# Altium project STM32F7-SOM-OLD.PrjPcb
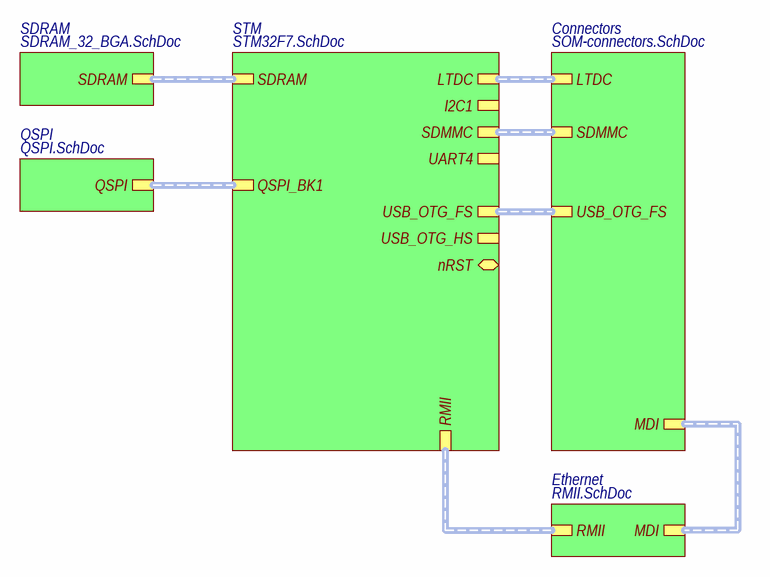
[diagram p0: Top.SchDoc]
Утвердил: Кадыров; ТипДокумента2: Монтажная схема; ТипДокумента1: Схема электрическая принципиальная; Технолог: Терехов; Разработал: Валиуллин; Проверил: Кадыров; ПервичноеПрименение: ВС01; Обозначение2: ="DesignName"+"-5"+"Revision"+"2"; Обозначение1: ="DesignName"+"-5"+"Revision"+"1"; Наименование: Плата лицевой панели; Масштаб: 1:1; Литера1: A; Компания: Eleps; Revision: 1; DesignName: FP01-01
6 sheets, 92 parts. Net scope: hierarchical (ports join the sheet entries above them; power ports are global).
Board file: PCB.PcbDoc
Sheets:
  Top.SchDoc
    SDRAM = SDRAM_32_BGA.SchDoc
    STM = STM32F7.SchDoc
    QSPI = QSPI.SchDoc
    Connectors = SOM-connectors.SchDoc
    Ethernet = RMII.SchDoc

## Sheet Top.SchDoc
size 209 x 297 mm; PageSetup: Record=PageOptions|CenterHorizontal=True|CenterVertical=True|PrintScale=1.00|XCorrection=1.00|YCorrection=1.00|PrintKind=1|BorderSize=5000000|LeftOffset=0|BottomOffset=0|Orientation=2|PaperLength=1000|PaperWidth=1000|Scale=100|PaperSource=15|PrintQuality=1200|MediaType=1|DitherType=10|PaperKind=A3|PrintScaleMode=1; Letter1: A; Scale: 1:1; ListNumber: 1; SheetNumber: 1; SheetTotal: 6

### Sub-sheets
Connectors = SOM-connectors.SchDoc: LTDC (harness LTDC), MDI (harness MDI), SDMMC (harness SDMMC), USB_OTG_FS (harness USB_OTG)
Ethernet = RMII.SchDoc: RMII (harness RMII), MDI (harness MDI)
QSPI = QSPI.SchDoc: QSPI (harness RGMII)
SDRAM = SDRAM_32_BGA.SchDoc: SDRAM (harness SDRAM)
STM = STM32F7.SchDoc: SDRAM (harness SDRAM), QSPI_BK1 (harness QSPI), UART4 (harness UART), SDMMC (harness SDMMC), I2C1 (harness I2C), USB_OTG_FS (harness USB_OTG), USB_OTG_HS (harness USB_OTG), LTDC (harness LTDC), RMII (harness RMII), nRST (bidir)

### Buses and harness runs
harness sheet Connectors/LTDC = sheet STM/LTDC
harness sheet Connectors/MDI = sheet Ethernet/MDI
harness sheet Connectors/SDMMC = sheet STM/SDMMC
harness sheet Connectors/USB_OTG_FS = sheet STM/USB_OTG_FS
harness sheet Ethernet/RMII = sheet STM/RMII
harness sheet QSPI/QSPI = sheet STM/QSPI_BK1
harness sheet SDRAM/SDRAM = sheet STM/SDRAM

### Notes on the sheet
- Перв. примен.
- Справ. №
- Подп. и дата
- Инв. № дубл.
- Взам. инв. №
- Разраб.
- Изм.
- Лист
- № докум.
- Подп.
- Дата
- Лит.
- Масса
- Масштаб
- Пров.
- Т. контр.
- Листов
- Инв. № подл.
- Н. контр.
- Утв.
- Копировал
- Формат А4

## Sheet SDRAM_32_BGA.SchDoc
size 420 x 297 mm; SheetNumber: 4; SheetTotal: 6; ListNumber: 2
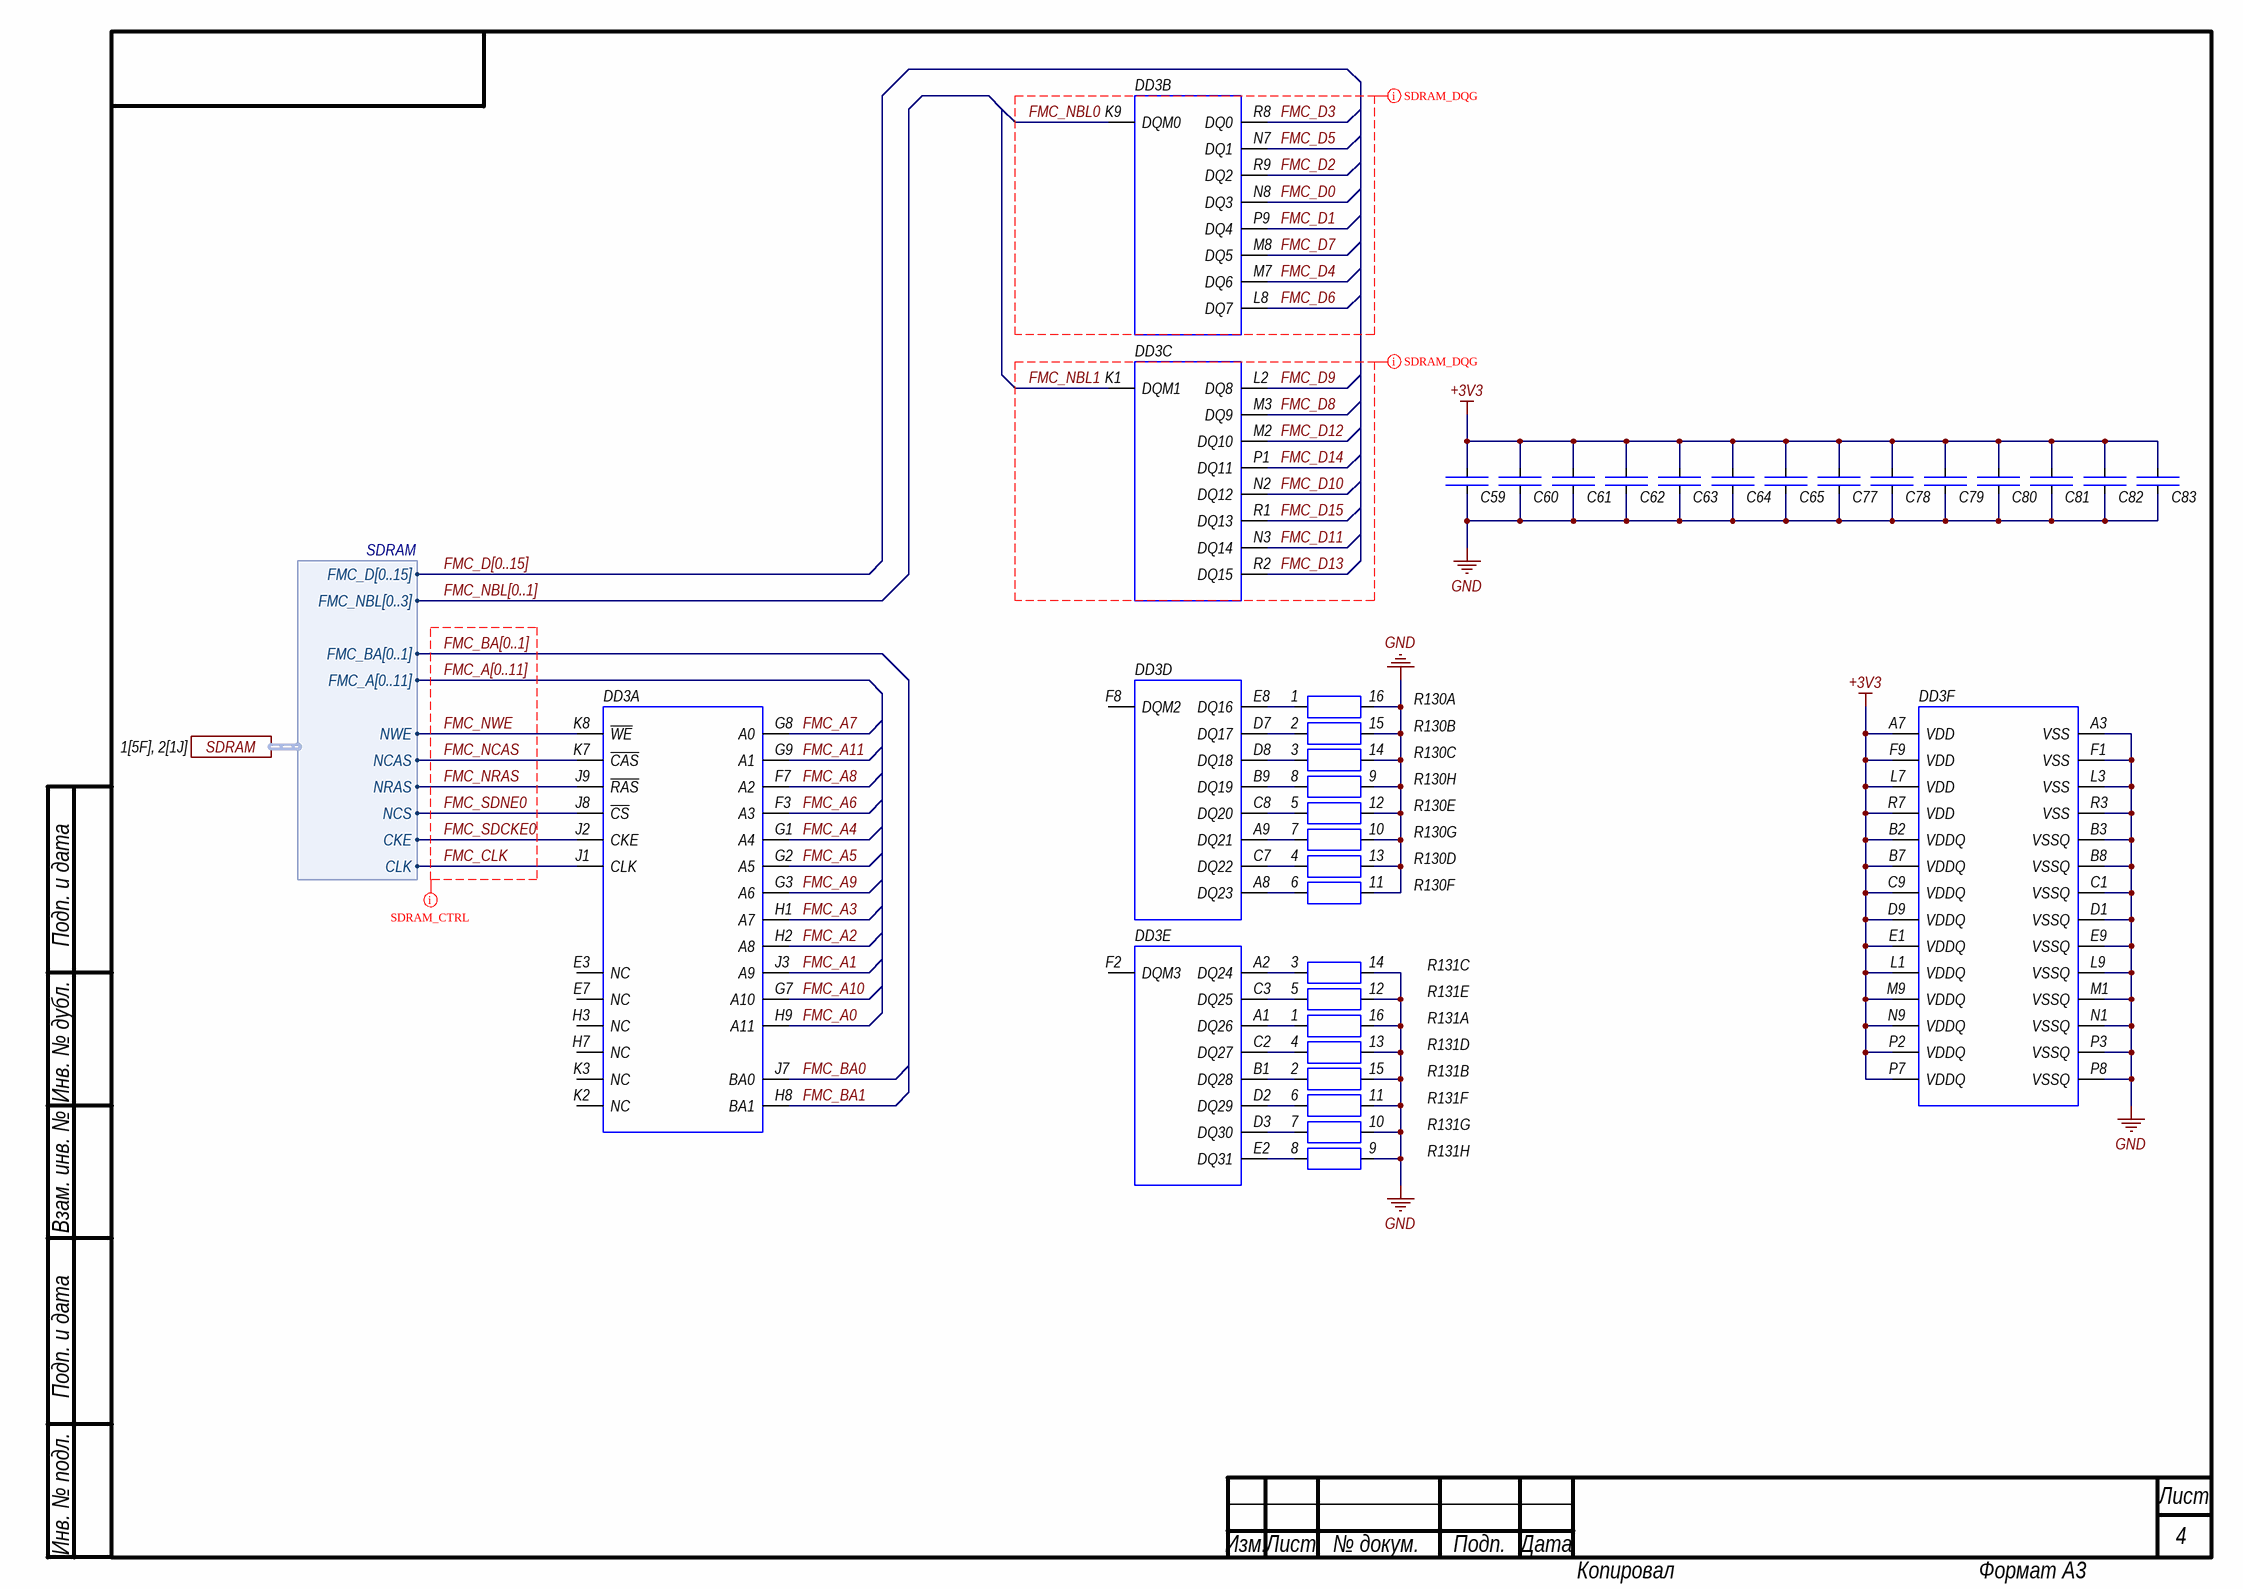
[diagram p1: SDRAM_32_BGA.SchDoc]

### Parts
C59  Конденсатор керам. ЧИП X5R, 10%, 0402, 0.1 мкФ  [Capacitor 0402]  (value not drawn)
C60  Конденсатор керам. ЧИП X5R, 10%, 0402, 0.1 мкФ  [Capacitor 0402]  (value not drawn)
C61  Конденсатор керам. ЧИП X5R, 10%, 0402, 0.1 мкФ  [Capacitor 0402]  (value not drawn)
C62  Конденсатор керам. ЧИП X5R, 10%, 0402, 0.1 мкФ  [Capacitor 0402]  (value not drawn)
C63  Конденсатор керам. ЧИП X5R, 10%, 0402, 0.1 мкФ  [Capacitor 0402]  (value not drawn)
C64  Конденсатор керам. ЧИП X5R, 10%, 0402, 0.1 мкФ  [Capacitor 0402]  (value not drawn)
C65  Конденсатор керам. ЧИП X5R, 10%, 0402, 0.1 мкФ  [Capacitor 0402]  (value not drawn)
C77  Конденсатор керам. ЧИП X5R, 10%, 0402, 0.1 мкФ  [Capacitor 0402]  (value not drawn)
C78  Конденсатор керам. ЧИП X5R, 10%, 0402, 0.1 мкФ  [Capacitor 0402]  (value not drawn)
C79  Конденсатор керам. ЧИП X5R, 10%, 0402, 0.1 мкФ  [Capacitor 0402]  (value not drawn)
C80  Конденсатор керам. ЧИП X5R, 10%, 0402, 0.1 мкФ  [Capacitor 0402]  (value not drawn)
C81  Конденсатор керам. ЧИП X5R, 10%, 0402, 0.1 мкФ  [Capacitor 0402]  (value not drawn)
C82  Конденсатор керам. ЧИП X5R, 10%, 0402, 0.1 мкФ  [Capacitor 0402]  (value not drawn)
C83  Конденсатор керам. ЧИП X5R, 10%, 0402, 0.1 мкФ  [Capacitor 0402]  (value not drawn)
DD3  Микросхема IS42S32400F-6BL  [BGA90C80P9X15_800X1300X120]  (value not drawn)  (parts A,B,C,D,E,F of 6)
R130  8-Resistor  [RESNET_1506-16_CONVEX]  (value not drawn)  (parts A,B,C,D,E,F,G,H of 8)
R131  8-Resistor  [RESNET_1506-16_CONVEX]  (value not drawn)  (parts A,B,C,D,E,F,G,H of 8)

### Ports
SDRAM (harness SDRAM, see 1[5F], 2[1J])

### Harnesses
SDRAM: FMC_D[0..15], NCAS, FMC_BA[0..1], NWE, FMC_A[0..11], NRAS, NCS, CLK, CKE, FMC_NBL[0..3]

### Nets
+3V3: C59.1 C60.1 C61.1 C62.1 C63.1 C64.1 C65.1 C77.1 C78.1 C79.1 C80.1 C81.1 C82.1 C83.1 DD3.A7(VDD) DD3.B2(VDDQ) DD3.B7(VDDQ) DD3.C9(VDDQ) DD3.D9(VDDQ) DD3.E1(VDDQ) DD3.F9(VDD) DD3.L1(VDDQ) DD3.L7(VDD) DD3.M9(VDDQ) DD3.N9(VDDQ) DD3.P2(VDDQ) DD3.P7(VDDQ) DD3.R7(VDD)
GND: C59.2 C60.2 C61.2 C62.2 C63.2 C64.2 C65.2 C77.2 C78.2 C79.2 C80.2 C81.2 C82.2 C83.2 DD3.A3(VSS) DD3.B3(VSSQ) DD3.B8(VSSQ) DD3.C1(VSSQ) DD3.D1(VSSQ) DD3.E9(VSSQ) DD3.F1(VSS) DD3.L3(VSS) DD3.L9(VSSQ) DD3.M1(VSSQ) DD3.N1(VSSQ) DD3.P3(VSSQ) DD3.P8(VSSQ) DD3.R3(VSS) R130.9 R130.10 R130.11 R130.12 R130.13 R130.14 R130.15 R130.16 R131.9 R131.10 R131.11 R131.12 R131.13 R131.14 R131.15 R131.16
FMC_A0: DD3.H9(A11)
FMC_A1: DD3.J3(A9)
FMC_A2: DD3.H2(A8)
FMC_A3: DD3.H1(A7)
FMC_A4: DD3.G1(A4)
FMC_A5: DD3.G2(A5)
FMC_A6: DD3.F3(A3)
FMC_A7: DD3.G8(A0)
FMC_A8: DD3.F7(A2)
FMC_A9: DD3.G3(A6)
FMC_A10: DD3.G7(A10)
FMC_A11: DD3.G9(A1)
FMC_BA0: DD3.J7(BA0)
FMC_BA1: DD3.H8(BA1)
FMC_CLK: DD3.J1(CLK) ; port SDRAM.CLK
FMC_D0: DD3.N8(DQ3)
FMC_D1: DD3.P9(DQ4)
FMC_D2: DD3.R9(DQ2)
FMC_D3: DD3.R8(DQ0)
FMC_D4: DD3.M7(DQ6)
FMC_D5: DD3.N7(DQ1)
FMC_D6: DD3.L8(DQ7)
FMC_D7: DD3.M8(DQ5)
FMC_D8: DD3.M3(DQ9)
FMC_D9: DD3.L2(DQ8)
FMC_D10: DD3.N2(DQ12)
FMC_D11: DD3.N3(DQ14)
FMC_D12: DD3.M2(DQ10)
FMC_D13: DD3.R2(DQ15)
FMC_D14: DD3.P1(DQ11)
FMC_D15: DD3.R1(DQ13)
FMC_NBL0: DD3.K9(DQM0)
FMC_NBL1: DD3.K1(DQM1)
FMC_NCAS: DD3.K7(~{CAS}) ; port SDRAM.NCAS
FMC_NRAS: DD3.J9(~{RAS}) ; port SDRAM.NRAS
FMC_NWE: DD3.K8(~{WE}) ; port SDRAM.NWE
FMC_SDCKE0: DD3.J2(CKE) ; port SDRAM.CKE
FMC_SDNE0: DD3.J8(~{CS}) ; port SDRAM.NCS
NetDD3_A1: DD3.A1(DQ26) R131.1
NetDD3_A2: DD3.A2(DQ24) R131.3
NetDD3_A8: DD3.A8(DQ23) R130.6
NetDD3_A9: DD3.A9(DQ21) R130.7
NetDD3_B1: DD3.B1(DQ28) R131.2
NetDD3_B9: DD3.B9(DQ19) R130.8
NetDD3_C2: DD3.C2(DQ27) R131.4
NetDD3_C3: DD3.C3(DQ25) R131.5
NetDD3_C7: DD3.C7(DQ22) R130.4
NetDD3_C8: DD3.C8(DQ20) R130.5
NetDD3_D2: DD3.D2(DQ29) R131.6
NetDD3_D3: DD3.D3(DQ30) R131.7
NetDD3_D7: DD3.D7(DQ17) R130.2
NetDD3_D8: DD3.D8(DQ18) R130.3
NetDD3_E2: DD3.E2(DQ31) R131.8
NetDD3_E8: DD3.E8(DQ16) R130.1

Not connected (* = marked no-connect by the designer): DD3 E3(NC) E7(NC) F2(DQM3) F8(DQM2) H3(NC) H7(NC) K2(NC) K3(NC)

### Buses and harness runs
bus FMC_A[0..11]
bus FMC_BA[0..1]
bus FMC_D[0..15]
bus FMC_NBL[0..1]

### Layout directives
net class SDRAM_CTRL; rule Matched Net Lengths [Delay Tolerance = 200ps]: FMC_A[0..11], FMC_BA[0..1], FMC_CLK, FMC_NCAS, FMC_NRAS, FMC_NWE, FMC_SDCKE0, FMC_SDNE0
net class SDRAM_DQM0; rule Matched Net Lengths [Delay Tolerance = 100ps]: FMC_D0, FMC_D1, FMC_D2, FMC_D3, FMC_D4, FMC_D5, FMC_D6, FMC_D7, FMC_NBL0
net class SDRAM_DQM1; rule Matched Net Lengths [Delay Tolerance = 100ps]: FMC_D8, FMC_D9, FMC_D10, FMC_D11, FMC_D12, FMC_D13, FMC_D14, FMC_D15, FMC_NBL1

### Notes on the sheet
- Подп. и дата
- Инв. № дубл.
- Взам. инв. №
- Инв. № подл.
- Изм.
- Лист
- № докум.
- Подп.
- Дата
- Копировал
- Формат А3

### Library data of the parts
C59-C65 C77-C83 = 000821-3: Cap Ceramic 0.1uF 50V X5R 10% Pad SMD 0402 85C T/R; Manufacturer: Murata Manufacturing; Manufacturer Part Number: GRM155R61H104KE14J; Device: 100nFx50V; Capacitance: 100nF; PCAD Reader Code: 0; Info: 100nFx50V; Voltage: 50V; Case: 0402; Pin Count: 2; Help URL: https://www.digikey.com/en/products/detail/murata-electronics/GRM155R61H104KE14J/4905153; Storage Code: 0; Dielectric: X5R; Tolerance: 10%
DD3 = IS42S32400F-6BL: 128Mb (4M x 32) Synchronous DRAM; Part Number: IS42S32400F-6BL; Device: IS42S32400F-6BL; Info: IS42S32400F-6BL; Case: 90-Ball TF-BGA; Manufacturer Part Number: IS42S32400F-6BL; Pin Count: 90
R130 R131 = EXB2HV103JV: Manufacturer: Panasonic; Device: 10k; Part Number: EXB2HV103JV; Info: 10k; Resistance: 10k; Case: SMD-1506; Manufacturer Part Number: EXB2HV103JV; Pin Count: 16

## Sheet STM32F7.SchDoc
size 840 x 594 mm; SheetNumber: 2; SheetTotal: 6; ListNumber: 2
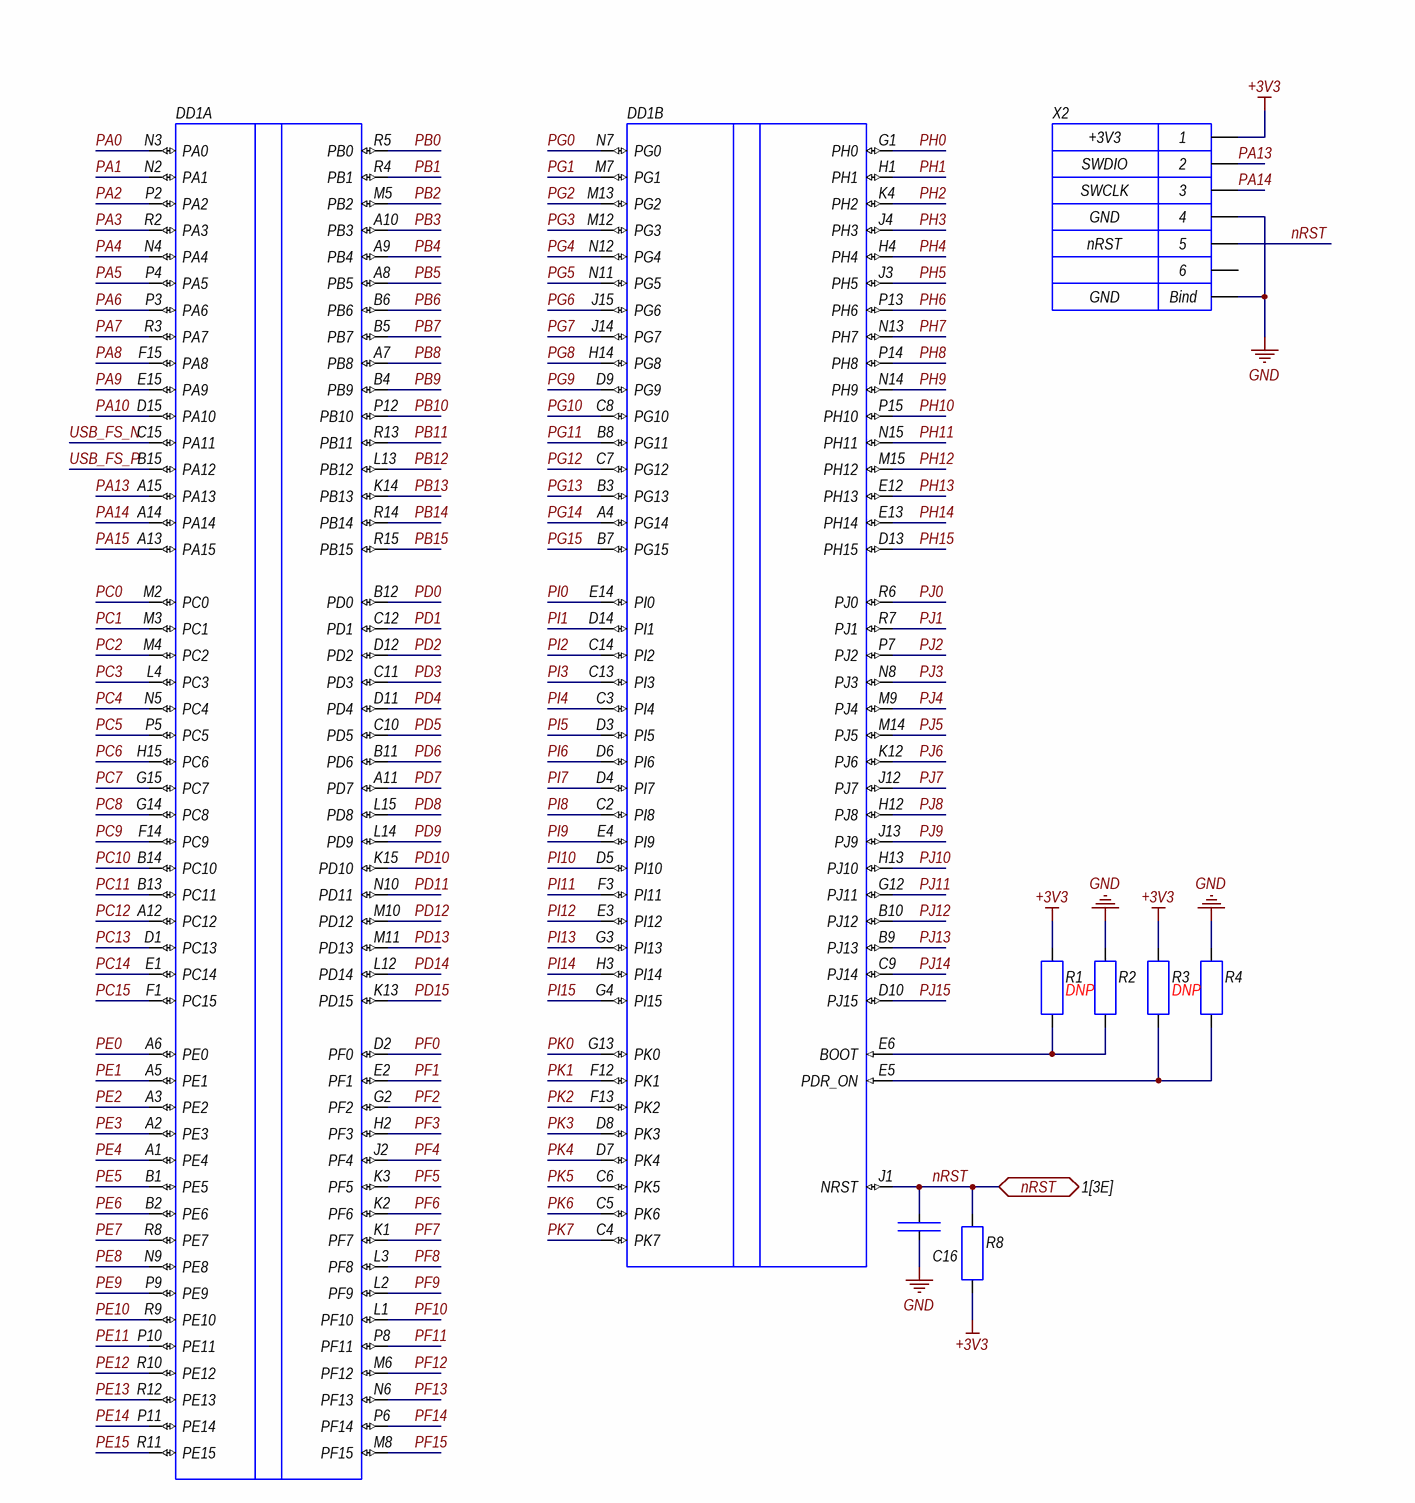
[diagram p2: STM32F7.SchDoc, top left]
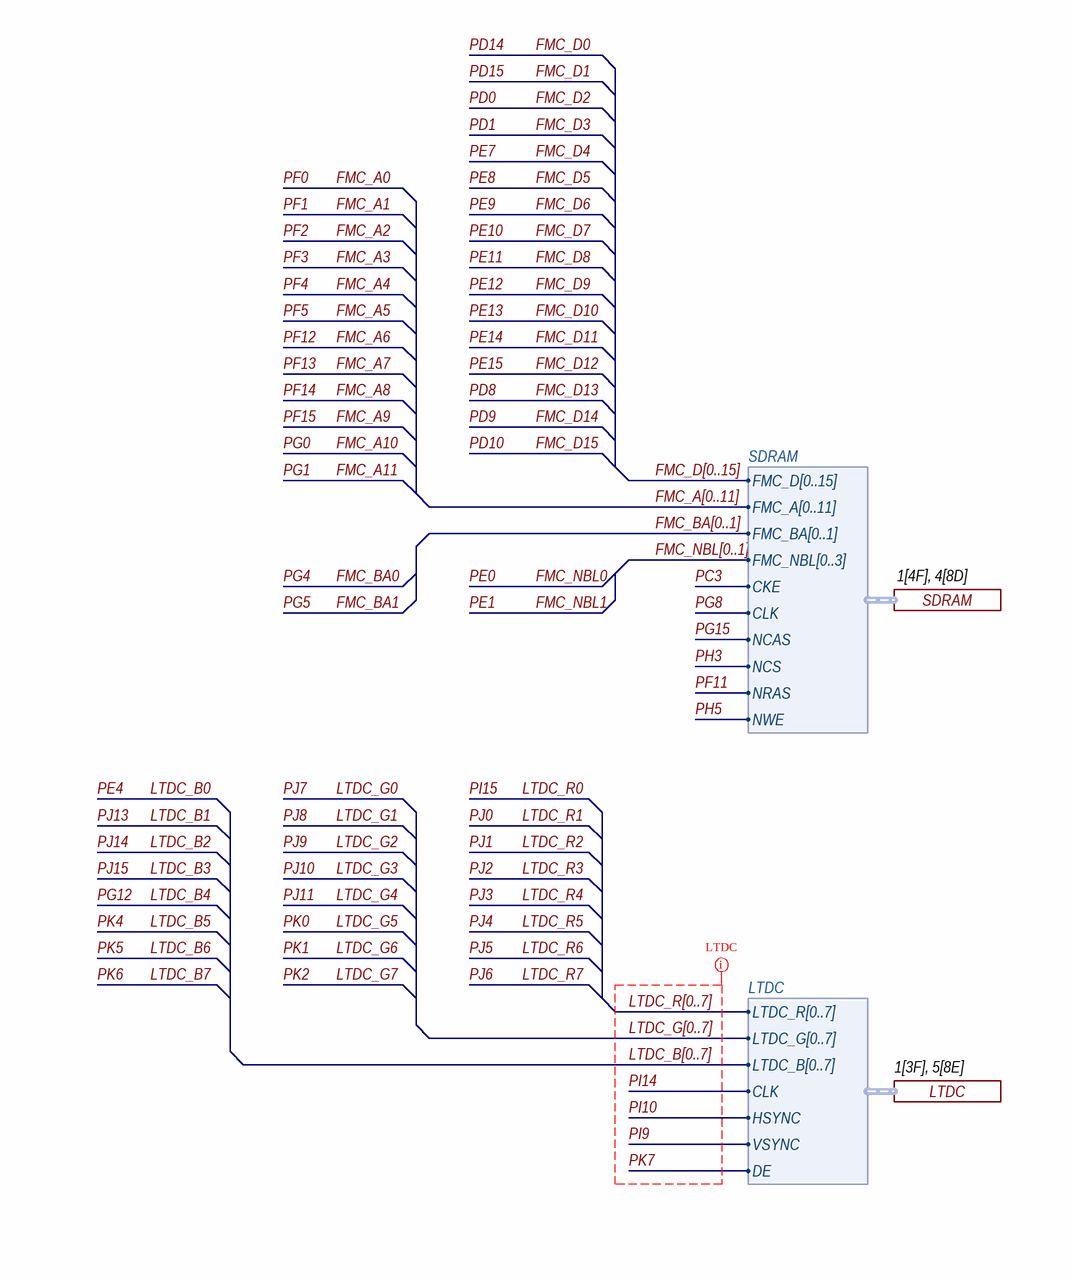
[diagram p3: STM32F7.SchDoc, top right]
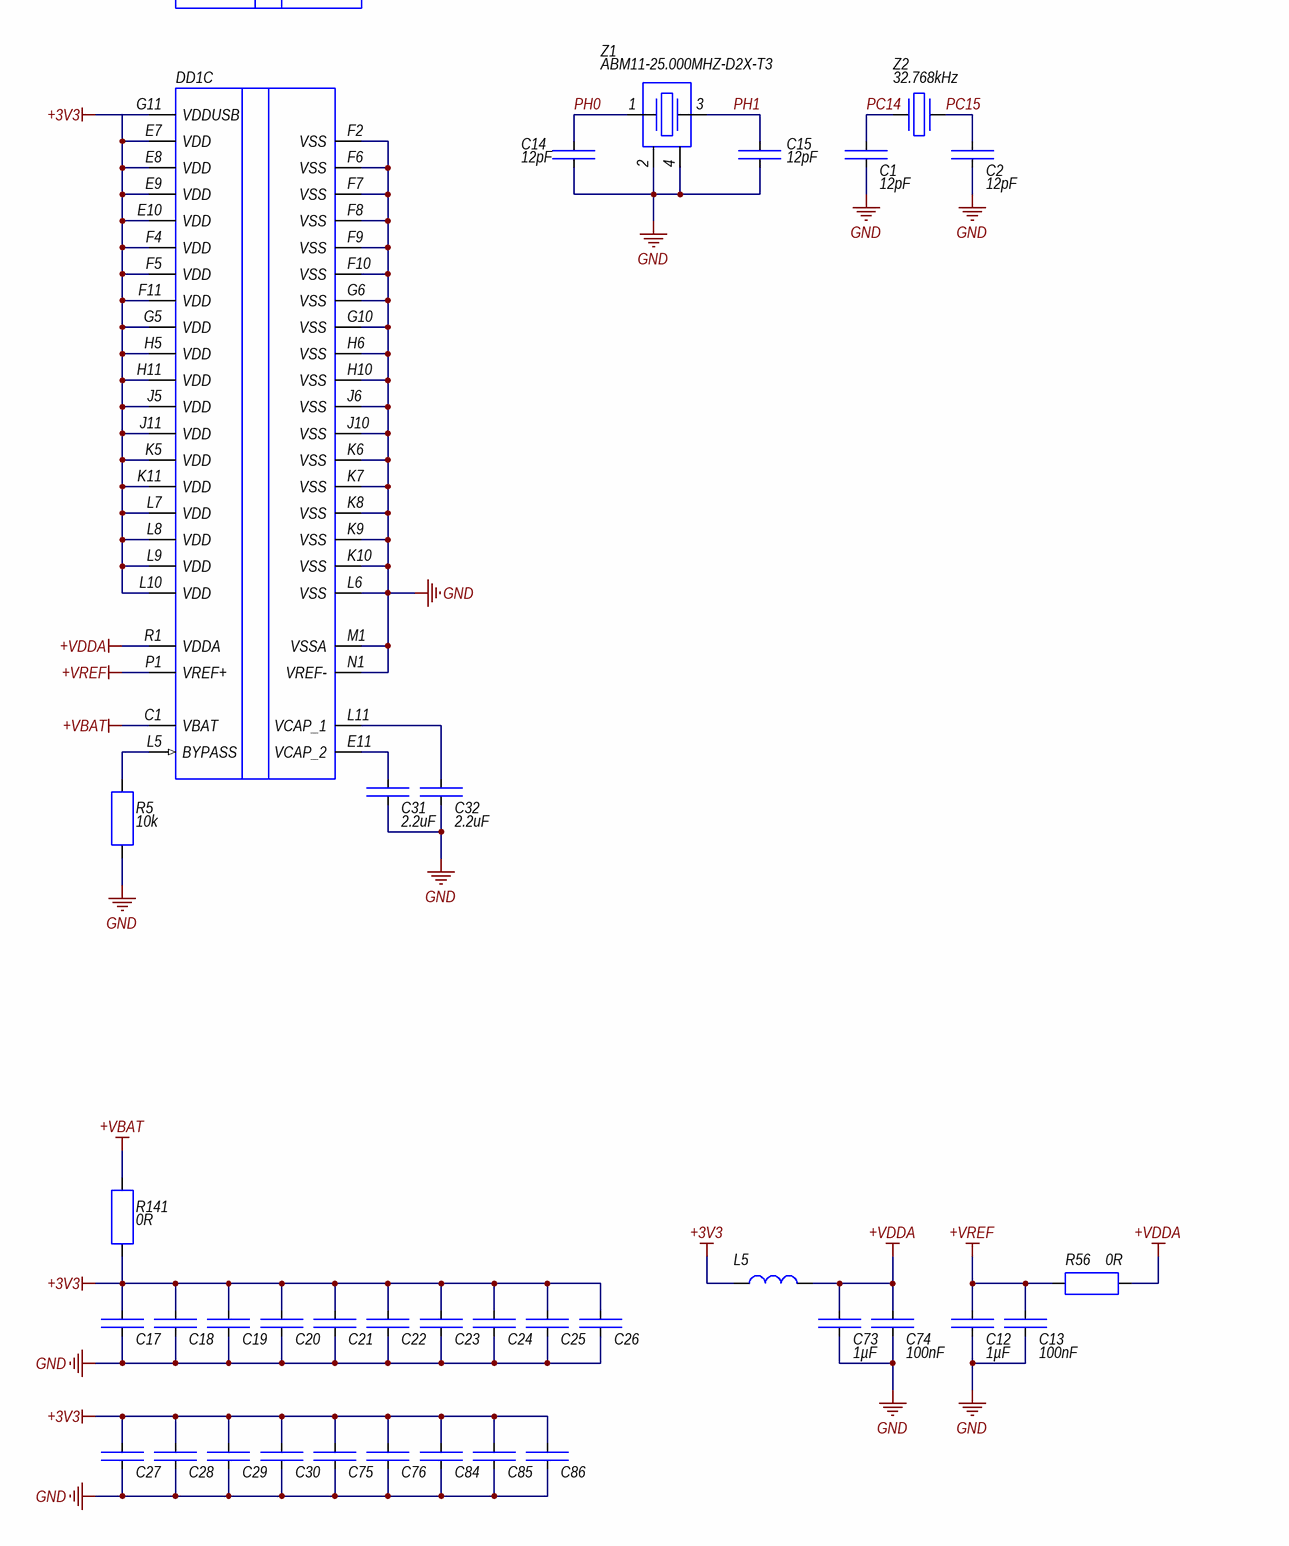
[diagram p4: STM32F7.SchDoc, bottom left]
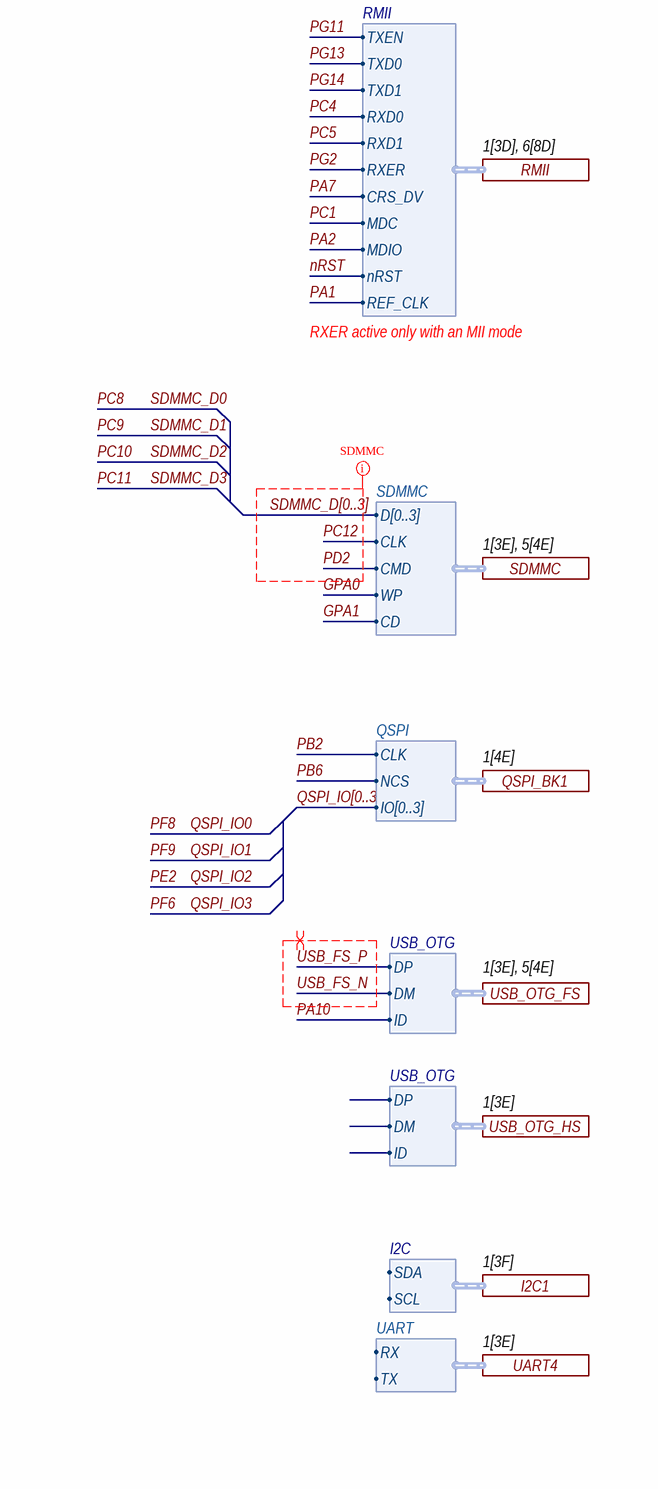
[diagram p5: STM32F7.SchDoc, bottom right]

### Parts
C1  Capacitance: 12pF  [Capacitor 0402]  (hidden comment: Конденсатор керам. ЧИП NP0, 5%, 0402, 12 пФ)
C2  Capacitance: 12pF  [Capacitor 0402]  (hidden comment: Конденсатор керам. ЧИП NP0, 5%, 0402, 12 пФ)
C12  Capacitance: 1µF  [Capacitor 0603]  (hidden comment: Конденсатор керам. ЧИП X5R, 10%, 0603, 1 мкФ)
C13  Capacitance: 100nF  [Capacitor 0603]  (hidden comment: Конденсатор керам. ЧИП X7R, 10%, 0603, 0.1 мкФ)
C14  Capacitance: 12pF  [Capacitor 0402]  (hidden comment: Конденсатор керам. ЧИП NP0, 5%, 0402, 12 пФ)
C15  Capacitance: 12pF  [Capacitor 0402]  (hidden comment: Конденсатор керам. ЧИП NP0, 5%, 0402, 12 пФ)
C16  Конденсатор керам. ЧИП X5R, 10%, 0402, 0.1 мкФ  [Capacitor 0402]  (value not drawn)
C17  Конденсатор керам. ЧИП X5R, 10%, 0402, 0.1 мкФ  [Capacitor 0402]  (value not drawn)
C18  Конденсатор керам. ЧИП X5R, 10%, 0402, 0.1 мкФ  [Capacitor 0402]  (value not drawn)
C19  Конденсатор керам. ЧИП X5R, 10%, 0402, 0.1 мкФ  [Capacitor 0402]  (value not drawn)
C20  Конденсатор керам. ЧИП X5R, 10%, 0402, 0.1 мкФ  [Capacitor 0402]  (value not drawn)
C21  Конденсатор керам. ЧИП X5R, 10%, 0402, 0.1 мкФ  [Capacitor 0402]  (value not drawn)
C22  Конденсатор керам. ЧИП X5R, 10%, 0402, 0.1 мкФ  [Capacitor 0402]  (value not drawn)
C23  Конденсатор керам. ЧИП X5R, 10%, 0402, 0.1 мкФ  [Capacitor 0402]  (value not drawn)
C24  Конденсатор керам. ЧИП X5R, 10%, 0402, 0.1 мкФ  [Capacitor 0402]  (value not drawn)
C25  Конденсатор керам. ЧИП X5R, 10%, 0402, 0.1 мкФ  [Capacitor 0402]  (value not drawn)
C26  Конденсатор керам. ЧИП X5R, 10%, 0402, 0.1 мкФ  [Capacitor 0402]  (value not drawn)
C27  Конденсатор керам. ЧИП X5R, 10%, 0402, 0.1 мкФ  [Capacitor 0402]  (value not drawn)
C28  Конденсатор керам. ЧИП X5R, 10%, 0402, 0.1 мкФ  [Capacitor 0402]  (value not drawn)
C29  Конденсатор керам. ЧИП X5R, 10%, 0402, 0.1 мкФ  [Capacitor 0402]  (value not drawn)
C30  Конденсатор керам. ЧИП X5R, 10%, 0402, 0.1 мкФ  [Capacitor 0402]  (value not drawn)
C31  Capacitance: 2.2uF  [SMD_1206]  (hidden comment: NCap)
C32  Capacitance: 2.2uF  [SMD_1206]  (hidden comment: NCap)
C73  Capacitance: 1µF  [Capacitor 0603]  (hidden comment: Конденсатор керам. ЧИП X5R, 10%, 0603, 1 мкФ)
C74  Capacitance: 100nF  [Capacitor 0603]  (hidden comment: Конденсатор керам. ЧИП X7R, 10%, 0603, 0.1 мкФ)
C75  Конденсатор керам. ЧИП X5R, 10%, 0402, 0.1 мкФ  [Capacitor 0402]  (value not drawn)
C76  Конденсатор керам. ЧИП X5R, 10%, 0402, 0.1 мкФ  [Capacitor 0402]  (value not drawn)
C84  Конденсатор керам. ЧИП X5R, 10%, 0402, 0.1 мкФ  [Capacitor 0402]  (value not drawn)
C85  Конденсатор керам. ЧИП X5R, 10%, 0402, 0.1 мкФ  [Capacitor 0402]  (value not drawn)
C86  Конденсатор керам. ЧИП X5R, 10%, 0402, 0.1 мкФ  [Capacitor 0402]  (value not drawn)
DD1  Микросхема STM32F746NGH6  [STM-TFBGA216]  (value not drawn)  (parts A,B,C of 3)
L5  Дроссель BLM18HE152SN1D  [BLM18HE152SN1D]  (value not drawn)
R1  (no value)  [SMD_0402]
R2  (no value)  [SMD_0402]
R3  (no value)  [SMD_0402]
R4  (no value)  [SMD_0402]
R5  Resistance: 10k  [SMD_0402]
R8  (no value)  [SMD_0402]
R56  Device: 0R  [SMD_0402]  (hidden comment: Resistor)
R141  Resistance: 0R  [SMD_0402]
X2  Вилка DF13C-6P-1.25V(50)  [DF13C-6P-1.25V(50)]  (value not drawn)
Z1  Manufacturer Part Number: ABM11-25.000MHZ-D2X-T3  [ABM11-MFG]  (hidden comment: Резонатор ABM11-25.000MHZ-D2X-T3)
Z2  Резонатор NX3215SA 32.768 кГц  [FP-NX3215SA-MFG]  (value not drawn)

### Ports
I2C1 (harness I2C, see 1[3F]), LTDC (harness LTDC, see 1[3F], 5[8E]), nRST (bidir, see 1[3E]), QSPI_BK1 (harness QSPI, see 1[4E]), RMII (harness RMII, see 1[3D], 6[8D]), SDMMC (harness SDMMC, see 1[3E], 5[4E]), SDRAM (harness SDRAM, see 1[4F], 4[8D]), UART4 (harness UART, see 1[3E]), USB_OTG_FS (harness USB_OTG, see 1[3E], 5[4E]), USB_OTG_HS (harness USB_OTG, see 1[3E])

### Harnesses
SDRAM: FMC_A[0..11], FMC_BA[0..1], CKE, CLK, FMC_D[0..15], FMC_NBL[0..3], NCAS, NCS, NRAS, NWE
LTDC: CLK, DE, HSYNC, LTDC_B[0..7], LTDC_G[0..7], LTDC_R[0..7], VSYNC
QSPI: CLK, NCS, IO[0..3]
UART: RX, TX
SDMMC: CD, CLK, CMD, D[0..3], WP
USB_OTG: DP, DM, ID
I2C: SDA, SCL
RMII: TXEN, TXD0, RXD0, RXD1, CRS_DV, RXER, MDC, MDIO, nRST, REF_CLK, TXD1

### Nets
+3V3: C17.1 C18.1 C19.1 C20.1 C21.1 C22.1 C23.1 C24.1 C25.1 C26.1 C27.1 C28.1 C29.1 C30.1 C75.1 C76.1 C84.1 C85.1 C86.1 DD1.E7(VDD) DD1.E8(VDD) DD1.E9(VDD) DD1.E10(VDD) DD1.F4(VDD) DD1.F5(VDD) DD1.F11(VDD) DD1.G5(VDD) DD1.G11(VDDUSB) DD1.H5(VDD) DD1.H11(VDD) DD1.J5(VDD) DD1.J11(VDD) DD1.K5(VDD) DD1.K11(VDD) DD1.L7(VDD) DD1.L8(VDD) DD1.L9(VDD) DD1.L10(VDD) L5.1 R1.2 R3.2 R8.1 R141.1 X2.1
+VBAT: DD1.C1(VBAT) R141.2
+VDDA: C73.1 C74.1 DD1.R1(VDDA) L5.2 R56.2
+VREF: C12.1 C13.1 DD1.P1(VREF+) R56.1
GND: C1.2 C2.2 C12.2 C13.2 C14.2 C15.2 C16.2 C17.2 C18.2 C19.2 C20.2 C21.2 C22.2 C23.2 C24.2 C25.2 C26.2 C27.2 C28.2 C29.2 C30.2 C31.2 C32.2 C73.2 C74.2 C75.2 C76.2 C84.2 C85.2 C86.2 DD1.F2(VSS) DD1.F6(VSS) DD1.F7(VSS) DD1.F8(VSS) DD1.F9(VSS) DD1.F10(VSS) DD1.G6(VSS) DD1.G10(VSS) DD1.H6(VSS) DD1.H10(VSS) DD1.J6(VSS) DD1.J10(VSS) DD1.K6(VSS) DD1.K7(VSS) DD1.K8(VSS) DD1.K9(VSS) DD1.K10(VSS) DD1.L6(VSS) DD1.M1(VSSA) DD1.N1(VREF-) R2.2 R4.2 R5.1 X2.0(Bind) X2.4 Z1.2 Z1.4
FMC_A0: DD1.D2(PF0)  [also labelled PF0]
FMC_A1: DD1.E2(PF1)  [also labelled PF1]
FMC_A2: DD1.G2(PF2)  [also labelled PF2]
FMC_A3: DD1.H2(PF3)  [also labelled PF3]
FMC_A4: DD1.J2(PF4)  [also labelled PF4]
FMC_A5: DD1.K3(PF5)  [also labelled PF5]
FMC_A6: DD1.M6(PF12)  [also labelled PF12]
FMC_A7: DD1.N6(PF13)  [also labelled PF13]
FMC_A8: DD1.P6(PF14)  [also labelled PF14]
FMC_A9: DD1.M8(PF15)  [also labelled PF15]
FMC_A10: DD1.N7(PG0)  [also labelled PG0]
FMC_A11: DD1.M7(PG1)  [also labelled PG1]
FMC_BA0: DD1.N12(PG4)  [also labelled PG4]
FMC_BA1: DD1.N11(PG5)  [also labelled PG5]
FMC_D0: DD1.L12(PD14)  [also labelled PD14]
FMC_D1: DD1.K13(PD15)  [also labelled PD15]
FMC_D2: DD1.B12(PD0)  [also labelled PD0]
FMC_D3: DD1.C12(PD1)  [also labelled PD1]
FMC_D4: DD1.R8(PE7)  [also labelled PE7]
FMC_D5: DD1.N9(PE8)  [also labelled PE8]
FMC_D6: DD1.P9(PE9)  [also labelled PE9]
FMC_D7: DD1.R9(PE10)  [also labelled PE10]
FMC_D8: DD1.P10(PE11)  [also labelled PE11]
FMC_D9: DD1.R10(PE12)  [also labelled PE12]
FMC_D10: DD1.R12(PE13)  [also labelled PE13]
FMC_D11: DD1.P11(PE14)  [also labelled PE14]
FMC_D12: DD1.R11(PE15)  [also labelled PE15]
FMC_D13: DD1.L15(PD8)  [also labelled PD8]
FMC_D14: DD1.L14(PD9)  [also labelled PD9]
FMC_D15: DD1.K15(PD10)  [also labelled PD10]
FMC_NBL0: DD1.A6(PE0)  [also labelled PE0]
FMC_NBL1: DD1.A5(PE1)  [also labelled PE1]
GPA0: port SDMMC.WP
GPA1: port SDMMC.CD
LTDC_B0: DD1.A1(PE4)  [also labelled PE4]
LTDC_B1: DD1.B9(PJ13)  [also labelled PJ13]
LTDC_B2: DD1.C9(PJ14)  [also labelled PJ14]
LTDC_B3: DD1.D10(PJ15)  [also labelled PJ15]
LTDC_B4: DD1.C7(PG12)  [also labelled PG12]
LTDC_B5: DD1.D7(PK4)  [also labelled PK4]
LTDC_B6: DD1.C6(PK5)  [also labelled PK5]
LTDC_B7: DD1.C5(PK6)  [also labelled PK6]
LTDC_G0: DD1.J12(PJ7)  [also labelled PJ7]
LTDC_G1: DD1.H12(PJ8)  [also labelled PJ8]
LTDC_G2: DD1.J13(PJ9)  [also labelled PJ9]
LTDC_G3: DD1.H13(PJ10)  [also labelled PJ10]
LTDC_G4: DD1.G12(PJ11)  [also labelled PJ11]
LTDC_G5: DD1.G13(PK0)  [also labelled PK0]
LTDC_G6: DD1.F12(PK1)  [also labelled PK1]
LTDC_G7: DD1.F13(PK2)  [also labelled PK2]
LTDC_R0: DD1.G4(PI15)  [also labelled PI15]
LTDC_R1: DD1.R6(PJ0)  [also labelled PJ0]
LTDC_R2: DD1.R7(PJ1)  [also labelled PJ1]
LTDC_R3: DD1.P7(PJ2)  [also labelled PJ2]
LTDC_R4: DD1.N8(PJ3)  [also labelled PJ3]
LTDC_R5: DD1.M9(PJ4)  [also labelled PJ4]
LTDC_R6: DD1.M14(PJ5)  [also labelled PJ5]
LTDC_R7: DD1.K12(PJ6)  [also labelled PJ6]
nRST: C16.1 DD1.J1(NRST) R8.2 X2.5 ; port nRST, port RMII.nRST
PA0: DD1.N3(PA0)
PA1: DD1.N2(PA1) ; port RMII.REF_CLK
PA2: DD1.P2(PA2) ; port RMII.MDIO
PA3: DD1.R2(PA3)
PA4: DD1.N4(PA4)
PA5: DD1.P4(PA5)
PA6: DD1.P3(PA6)
PA7: DD1.R3(PA7) ; port RMII.CRS_DV
PA8: DD1.F15(PA8)
PA9: DD1.E15(PA9)
PA10: DD1.D15(PA10) ; port USB_OTG_FS.ID
PA13: DD1.A15(PA13) X2.2
PA14: DD1.A14(PA14) X2.3
PA15: DD1.A13(PA15)
PB0: DD1.R5(PB0)
PB1: DD1.R4(PB1)
PB2: DD1.M5(PB2) ; port QSPI_BK1.CLK  [project net CLK]
PB3: DD1.A10(PB3)
PB4: DD1.A9(PB4)
PB5: DD1.A8(PB5)
PB6: DD1.B6(PB6) ; port QSPI_BK1.NCS  [project net NCS]
PB7: DD1.B5(PB7)
PB8: DD1.A7(PB8)
PB9: DD1.B4(PB9)
PB10: DD1.P12(PB10)
PB11: DD1.R13(PB11)
PB12: DD1.L13(PB12)
PB13: DD1.K14(PB13)
PB14: DD1.R14(PB14)
PB15: DD1.R15(PB15)
PC0: DD1.M2(PC0)
PC1: DD1.M3(PC1) ; port RMII.MDC
PC2: DD1.M4(PC2)
PC3: DD1.L4(PC3) ; port SDRAM.CKE  [project net FMC_SDCKE0]
PC4: DD1.N5(PC4) ; port RMII.RXD0
PC5: DD1.P5(PC5) ; port RMII.RXD1
PC6: DD1.H15(PC6)
PC7: DD1.G15(PC7)
PC8: DD1.G14(PC8)  [also labelled SDMMC_D0]
PC9: DD1.F14(PC9)  [also labelled SDMMC_D1]
PC10: DD1.B14(PC10)  [also labelled SDMMC_D2]
PC11: DD1.B13(PC11)  [also labelled SDMMC_D3]
PC12: DD1.A12(PC12) ; port SDMMC.CLK
PC13: DD1.D1(PC13)
PC14: C1.1 DD1.E1(PC14) Z2.1
PC15: C2.1 DD1.F1(PC15) Z2.2
PD2: DD1.D12(PD2) ; port SDMMC.CMD
PD3: DD1.C11(PD3)
PD4: DD1.D11(PD4)
PD5: DD1.C10(PD5)
PD6: DD1.B11(PD6)
PD7: DD1.A11(PD7)
PD11: DD1.N10(PD11)
PD12: DD1.M10(PD12)
PD13: DD1.M11(PD13)
PE2: DD1.A3(PE2)  [also labelled QSPI_IO2]
PE3: DD1.A2(PE3)
PE5: DD1.B1(PE5)
PE6: DD1.B2(PE6)
PF6: DD1.K2(PF6)  [also labelled QSPI_IO3]
PF7: DD1.K1(PF7)
PF8: DD1.L3(PF8)  [also labelled QSPI_IO0]
PF9: DD1.L2(PF9)  [also labelled QSPI_IO1]
PF10: DD1.L1(PF10)
PF11: DD1.P8(PF11) ; port SDRAM.NRAS  [project net FMC_NRAS]
PG2: DD1.M13(PG2) ; port RMII.RXER
PG3: DD1.M12(PG3)
PG6: DD1.J15(PG6)
PG7: DD1.J14(PG7)
PG8: DD1.H14(PG8) ; port SDRAM.CLK  [project net FMC_CLK]
PG9: DD1.D9(PG9)
PG10: DD1.C8(PG10)
PG11: DD1.B8(PG11) ; port RMII.TXEN
PG13: DD1.B3(PG13) ; port RMII.TXD0
PG14: DD1.A4(PG14) ; port RMII.TXD1
PG15: DD1.B7(PG15) ; port SDRAM.NCAS  [project net FMC_NCAS]
PH0: C14.1 DD1.G1(PH0) Z1.1
PH1: C15.1 DD1.H1(PH1) Z1.3
PH2: DD1.K4(PH2)
PH3: DD1.J4(PH3) ; port SDRAM.NCS  [project net FMC_SDNE0]
PH4: DD1.H4(PH4)
PH5: DD1.J3(PH5) ; port SDRAM.NWE  [project net FMC_NWE]
PH6: DD1.P13(PH6)
PH7: DD1.N13(PH7)
PH8: DD1.P14(PH8)
PH9: DD1.N14(PH9)
PH10: DD1.P15(PH10)
PH11: DD1.N15(PH11)
PH12: DD1.M15(PH12)
PH13: DD1.E12(PH13)
PH14: DD1.E13(PH14)
PH15: DD1.D13(PH15)
PI0: DD1.E14(PI0)
PI1: DD1.D14(PI1)
PI2: DD1.C14(PI2)
PI3: DD1.C13(PI3)
PI4: DD1.C3(PI4)
PI5: DD1.D3(PI5)
PI6: DD1.D6(PI6)
PI7: DD1.D4(PI7)
PI8: DD1.C2(PI8)
PI9: DD1.E4(PI9) ; port LTDC.VSYNC
PI10: DD1.D5(PI10) ; port LTDC.HSYNC
PI11: DD1.F3(PI11)
PI12: DD1.E3(PI12)
PI13: DD1.G3(PI13)
PI14: DD1.H3(PI14) ; port LTDC.CLK
PJ12: DD1.B10(PJ12)
PK3: DD1.D8(PK3)
PK7: DD1.C4(PK7) ; port LTDC.DE
USB_FS_N: DD1.C15(PA11) ; port USB_OTG_FS.DM
USB_FS_P: DD1.B15(PA12) ; port USB_OTG_FS.DP
NetC31_1: C31.1 DD1.E11(VCAP_2)
NetC32_1: C32.1 DD1.L11(VCAP_1)
NetDD1_E5: DD1.E5(PDR_ON) R3.1 R4.1
NetDD1_E6: DD1.E6(BOOT) R1.1 R2.1
NetDD1_L5: DD1.L5(BYPASS) R5.2

Not connected (* = marked no-connect by the designer): X2 6

### Buses and harness runs
bus FMC_A[0..11]
bus FMC_BA[0..1]
bus FMC_D[0..15]
bus FMC_NBL[0..1]
bus LTDC_B[0..7]
bus LTDC_G[0..7]
bus LTDC_R[0..7]
bus QSPI_IO[0..3]
bus SDMMC_D[0..3]

### Layout directives
net class RGB888: LTDC_B[0..7], LTDC_G[0..7], LTDC_R[0..7], PI9, PI10, PI14, PK7
net class SDMMC: PC12, PD2, SDMMC_D[0..3]
differential pair: USB_FS_N, USB_FS_P

### Notes on the sheet
- SWDIO
- +3V3
- SWCLK
- GND
- nRST
- DNP
- RXER active only with an MII mode
- Подп. и дата
- Инв. № дубл.
- Взам. инв. №
- Инв. № подл.
- Изм.
- Лист
- № докум.
- Подп.
- Дата
- Копировал
- Формат А1

### Library data of the parts
C1 C2 C14 C15 = 000818-5: Cap Ceramic 12pF 50V C0G 2% Pad SMD 0402 125C Automotive T/R; Manufacturer: Murata Manufacturing; Manufacturer Part Number: GCM1555C1H120GA16D; Info: 12pFx50V; PCAD Reader Code: 0; Device: 12pF; Voltage: 50V; Case: 0402; Pin Count: 2; Help URL: https://www.digikey.com/en/products/detail/murata-electronics/GCM1555C1H120GA16D/11618605; Storage Code: 0; Dielectric: C0G; Tolerance: 2%
C12 C73 = 000825-4: Multilayer Ceramic Capacitors MLCC - SMD/SMT 0603 50V 1.0uF X5R 10%; Manufacturer: Murata Electronics; Manufacturer Part Number: GRT188R61H105KE13D; Device: 1µFx50V; PCAD Reader Code: 0; Info: 1µFx50V; Voltage: 50V; Case: 0603; Pin Count: 2; Help URL: https://www.digikey.com/en/products/detail/murata-electronics/GRT188R61H105KE13D/5416752; Storage Code: 0; Dielectric: X5R; Tolerance: 10%
C13 C74 = 000129-5: Manufacturer: Yageo; Manufacturer Part Number: CC0603KPX7R9BB104; Device: 0.1uFx50V; Info: 100nFx50V; Voltage: 50V; PCAD Reader Code: 6100; Case: 0603; Pin Count: 2; Storage Code: 626; Dielectric: X7R
C16-C30 C75 C76 C84-C86 = 000821-3: as C59 on sheet SDRAM_32_BGA; Info: 100nFx50V; Voltage: 50V; Case: 0402; Pin Count: 2; Help URL: https://www.digikey.com/en/products/detail/murata-electronics/GRM155R61H104KE14J/4905153; Storage Code: 0; Dielectric: X5R; Tolerance: 10%
C31 C32 = Capacitor_1206: Device: 2.2uF; Info: 2.2uF; Part Number: Capacitor_1206
DD1 = STM32F746NGH6: ARM-Based Cortex-M7 32 Bit MCU+FPU, 462 DMIPS, 1024 kB Flash, 320 kB RAM, 168 I/Os, -40 to 85 degC, 216-Pin TFBGA, Halogen-Free, Tray; Manufacturer: STMicroelectronics; Part Number: STM32F746NGH6; Device: STM32F746NGH6; Info: STM32F746NGH6; Case: TFBGA-216; Manufacturer Part Number: STM32F746NGH6; Pin Count: 216
L5 = 000485-3: Ferrite bead; Manufacturer: Murata Electronics; PCAD Reader Code: 7562; Storage Code: 907; Manufacturer Part Number: BLM18HE152SN1D; Help URL: http://www.farnell.com/datasheets/1851896.pdf; Info: BLM18HE152SN1D; Case: BLM18HE152SN1D; Device: BLM18HE152SN1D; Pin Count: 2
R1-R5 R8 R56 R141 = Resistor_0402: Part Number: Resistor_0402; Pin Count: 2
  R5: Device: 10k; Info: 10k
  R56: Info: 0R; Resistance: 0R
  R141: Device: 0R; Info: 0R
X2 = 000336-3: PCAD Reader Code: 4403; Storage Code: 1360; Manufacturer Part Number: DF13C-6P-1.25V(50); Help URL: https://datasheet.octopart.com/DF13C-6P-1.25V%2850%29-Hirose-datasheet-2725.pdf; Info: DF13C-6P-1.25V(50); Case: https://www.snapeda.com/parts/DF13C-6P-1.25V%2850%29/Hirose%20Electric/view-part/?ref=search&t=DF13C-6P-1.25V(50); Device: DF13C-6P-1.25V(50); Pin Count: 6; Mounting: SMD
Z1 = 000855-2: Crystal 25MHz ±20ppm (Tol) ±20ppm (Stability) 10pF FUND 100Ohm 4-Pin Ultra Mini-CSMD T/R; Manufacturer: Abracon; PCAD Reader Code: 0; Shunt Capacitance: 7pF; Temperature Tolerance: 50ppm; Storage Code: 0; Help URL: https://www.farnell.com/datasheets/1936770.pdf; Info: ABM11-25.000MHZ-D2X-T3; Device: 25MHz; Frequency: 25MHz; Pin Count: 4; Frequency Tolerance: 20ppm; Load Capacitance: 10pF
Z2 = 000601-3: 32.768kHz; Manufacturer: NDK; Manufacturer Part Number: NX3215SA-32.768K-STD-MUA-8; PCAD Reader Code: 10090; Storage Code: 19559; Help URL: https://www.compel.ru/infosheet/NDK/NX3215SA-32.768K-STD-MUA-8; Info: 32.768kHz; Case: 3215; Device: 32.768kHz; Frequency: 32.768kHz; Pin Count: 2

## Sheet QSPI.SchDoc
size 209 x 297 mm; SheetNumber: 3; SheetTotal: 6
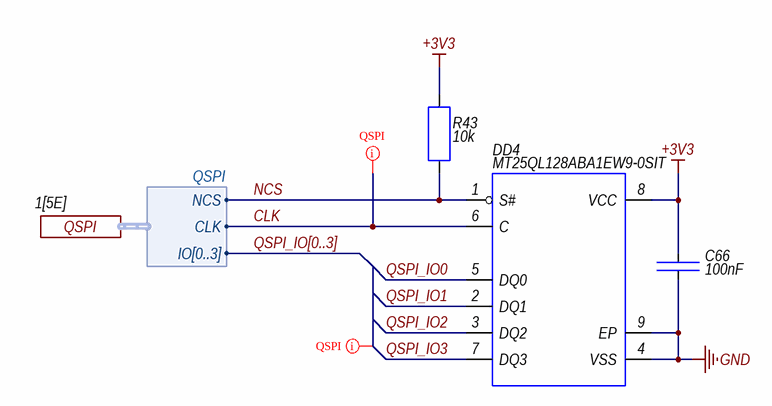
[diagram p6: QSPI.SchDoc]

### Parts
C66  Capacitance: 100nF  [Capacitor 0402]  (hidden comment: Конденсатор керам. ЧИП X5R, 10%, 0402, 0.1 мкФ)
DD4  Device: MT25QL128ABA1EW9-0SIT  [8-SON]  (hidden comment: Микросхема MT25QL128ABA1EW9-0SIT)
R43  Device: 10k  [SMD_0402]

### Ports
QSPI (harness QSPI, see 1[5E])

### Harnesses
QSPI: CLK, NCS, IO[0..3]

### Nets
+3V3: C66.1 DD4.8(VCC) R43.1
GND: C66.2 DD4.4(VSS) DD4.9(EP)
CLK: DD4.6(C) ; port QSPI.CLK
NCS: DD4.1(S#) R43.2 ; port QSPI.NCS
QSPI_IO0: DD4.5(DQ0)  [project net PF8]
QSPI_IO1: DD4.2(DQ1)  [project net PF9]
QSPI_IO2: DD4.3(DQ2)  [project net PE2]
QSPI_IO3: DD4.7(DQ3)  [project net PF6]

### Buses and harness runs
bus QSPI_IO[0..3]

### Layout directives
net class QUAD_QSPI; rule Matched Net Lengths [Delay Tolerance = 200ps]: (no net found under the mark), CLK

### Notes on the sheet
- Подп. и дата
- Инв. № дубл.
- Взам. инв. №
- Инв. № подл.
- Изм.
- Лист
- № докум.
- Подп.
- Дата
- Копировал
- Формат А4

### Library data of the parts
C66 = 000821-3: Cap Ceramic 0.1uF 50V X5R 10% Pad SMD 0402 85C T/R; Manufacturer: Murata Manufacturing; Manufacturer Part Number: GRM155R61H104KE14J; Device: 100nFx50V; PCAD Reader Code: 0; Info: 100nFx50V; Voltage: 50V; Case: 0402; Pin Count: 2; Help URL: https://www.digikey.com/en/products/detail/murata-electronics/GRM155R61H104KE14J/4905153; Storage Code: 0; Dielectric: X5R; Tolerance: 10%
DD4 = 000992-2: Micron Serial NOR Flash Memory; PCAD Reader Code: 0; Info: MT25QL128ABA1EW9-0SIT; Manufacturer: Micron; Case: SON-8; Manufacturer Part Number: MT25QL128ABA1EW9-0SIT; Storage Code: 0; Pin Count: 8
R43 = Resistor_0402: Part Number: Resistor_0402; Info: 10k; Resistance: 10k; Pin Count: 2

## Sheet SOM-connectors.SchDoc
size 420 x 297 mm; SheetNumber: 5; SheetTotal: 6; ListNumber: 2
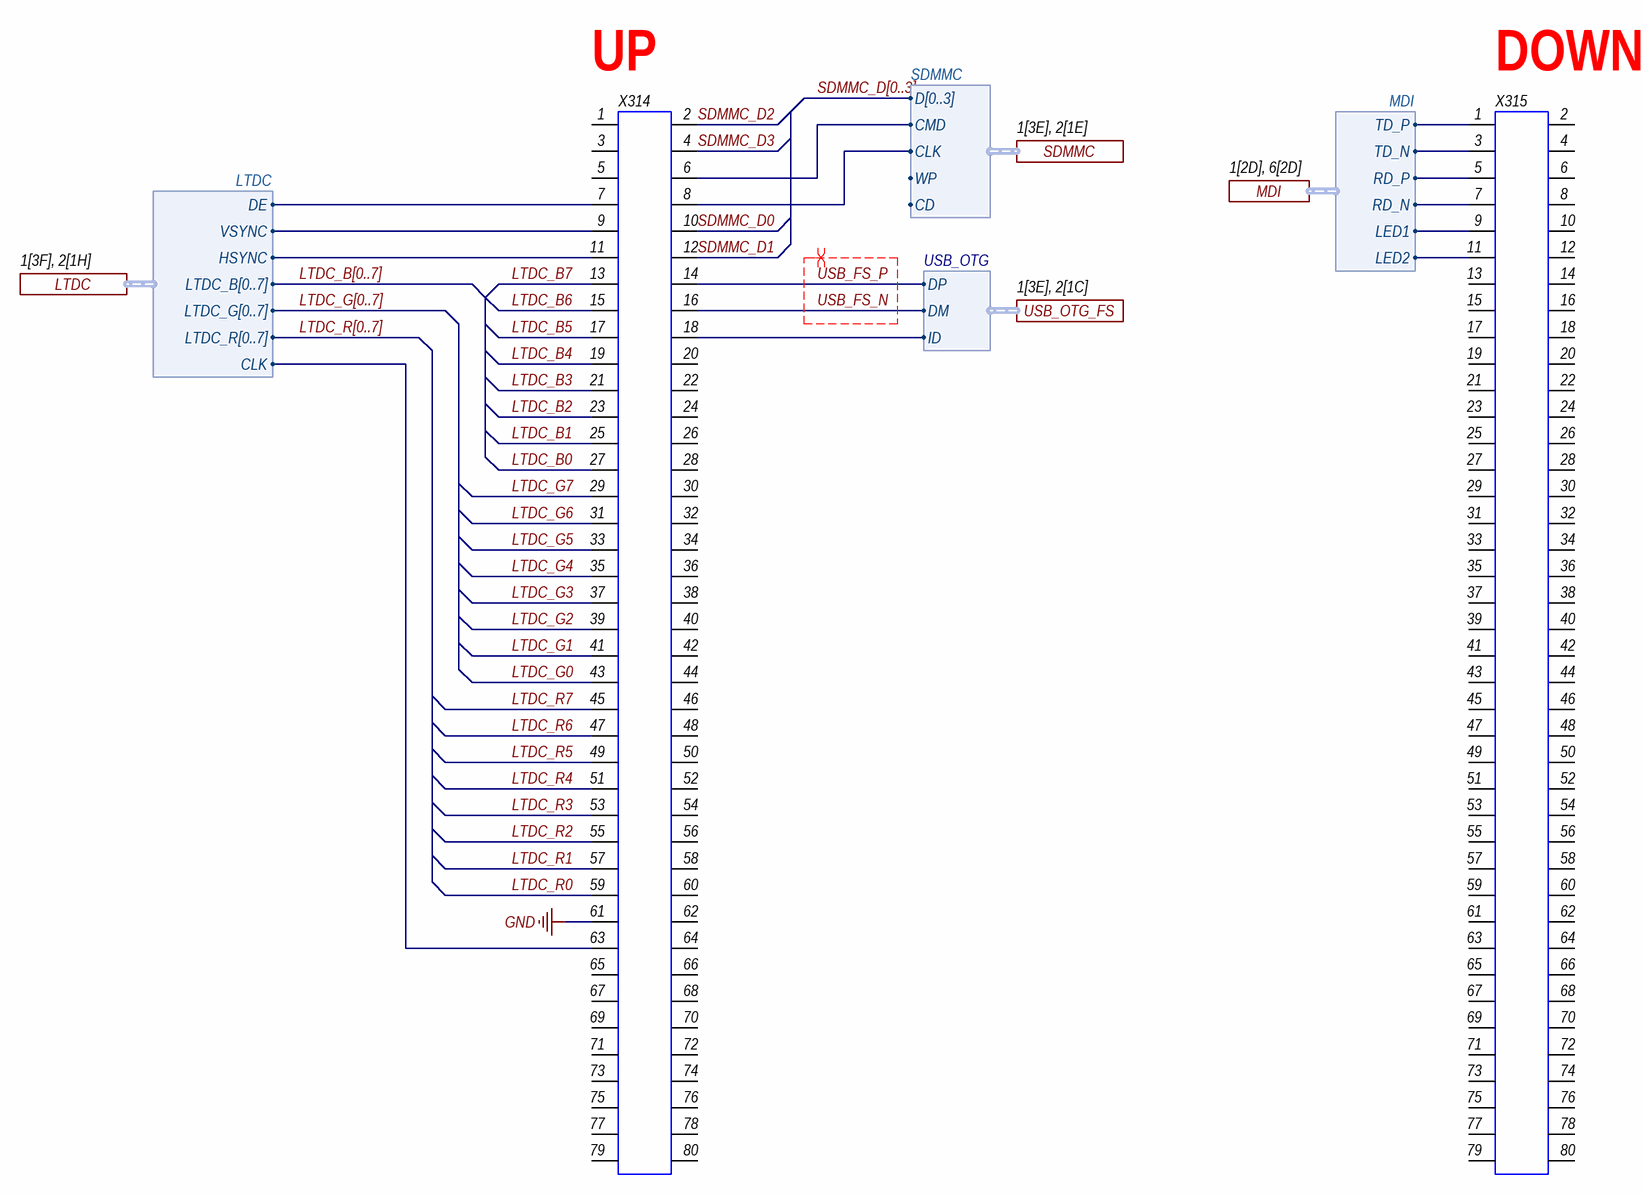
[diagram p7: SOM-connectors.SchDoc]

### Parts
X314  (no value)  [AXK6F80337YG]
X315  (no value)  [AXK6F80337YG]

### Ports
LTDC (harness LTDC, see 1[3F], 2[1H]), MDI (harness MDI, see 1[2D], 6[2D]), SDMMC (harness SDMMC, see 1[3E], 2[1E]), USB_OTG_FS (harness USB_OTG, see 1[3E], 2[1C])

### Harnesses
LTDC: CLK, DE, HSYNC, LTDC_B[0..7], LTDC_G[0..7], LTDC_R[0..7], VSYNC
MDI: TD_P, TD_N, RD_P, RD_N, LED1, LED2
SDMMC: CD, CLK, CMD, D[0..3], WP
USB_OTG: DP, DM, ID

### Nets
GND: X314.61
LTDC_B0: X314.27
LTDC_B1: X314.25
LTDC_B2: X314.23
LTDC_B3: X314.21
LTDC_B4: X314.19
LTDC_B5: X314.17
LTDC_B6: X314.15
LTDC_B7: X314.13
LTDC_G0: X314.43
LTDC_G1: X314.41
LTDC_G2: X314.39
LTDC_G3: X314.37
LTDC_G4: X314.35
LTDC_G5: X314.33
LTDC_G6: X314.31
LTDC_G7: X314.29
LTDC_R0: X314.59
LTDC_R1: X314.57
LTDC_R2: X314.55
LTDC_R3: X314.53
LTDC_R4: X314.51
LTDC_R5: X314.49
LTDC_R6: X314.47
LTDC_R7: X314.45
MDI_RD_N: X315.7 ; port MDI.RD_N
MDI_RD_P: X315.5 ; port MDI.RD_P
MDI_TD_N: X315.3 ; port MDI.TD_N
MDI_TD_P: X315.1 ; port MDI.TD_P
PA10: X314.18 ; port USB_OTG_FS.ID
PC12: X314.8 ; port SDMMC.CLK
PD2: X314.6 ; port SDMMC.CMD
PI9: X314.9 ; port LTDC.VSYNC
PI10: X314.11 ; port LTDC.HSYNC
PI14: X314.63 ; port LTDC.CLK
PK7: X314.7 ; port LTDC.DE
SDMMC_D0: X314.10  [project net PC8]
SDMMC_D1: X314.12  [project net PC9]
SDMMC_D2: X314.2  [project net PC10]
SDMMC_D3: X314.4  [project net PC11]
USB_FS_N: X314.16 ; port USB_OTG_FS.DM
USB_FS_P: X314.14 ; port USB_OTG_FS.DP
NetDD2_2: X315.11 ; port MDI.LED2
NetDD2_3: X315.9 ; port MDI.LED1

Not connected (* = marked no-connect by the designer): X314 1 3 5 20 22 24 26 28 30 32 34 36 38 40 42 44 46 48 50 52 54 56 58 60 62 64 65 66 67 68 69 70 71 72 73 74 75 76 77 78 79 80; X315 2 4 6 8 10 12 13 14 15 16 17 18 19 20 21 22 23 24 25 26 27 28 29 30 31 32 33 34 35 36 37 38 39 40 41 42 43 44 45 46 47 48 49 50 51 52 53 54 55 56 57 58 59 60 61 62 63 64 65 66 67 68 69 70 71 72 73 74 75 76 77 78 79 80

### Buses and harness runs
bus LTDC_B[0..7]
bus LTDC_G[0..7]
bus LTDC_R[0..7]
bus SDMMC_D[0..3]

### Layout directives
differential pair: USB_FS_N, USB_FS_P

### Notes on the sheet
- (near X314) UP
- (near X315) DOWN
- Подп. и дата
- Инв. № дубл.
- Взам. инв. №
- Инв. № подл.
- Изм.
- Лист
- № докум.
- Подп.
- Дата
- Копировал
- Формат А3

### Library data of the parts
X314 X315 = AXK6F80337YG: Manufacturer: Philips Semi; Part Number: AXK6F80337YG; Device: AXK6F80337YG; Info: AXK6F80337YG; Pin Count: 80; Manufacturer Part Number: AXK6F80337YG; Type: Вилка

## Sheet RMII.SchDoc
size 420 x 297 mm; SheetNumber: 6; SheetTotal: 6; ListNumber: 2
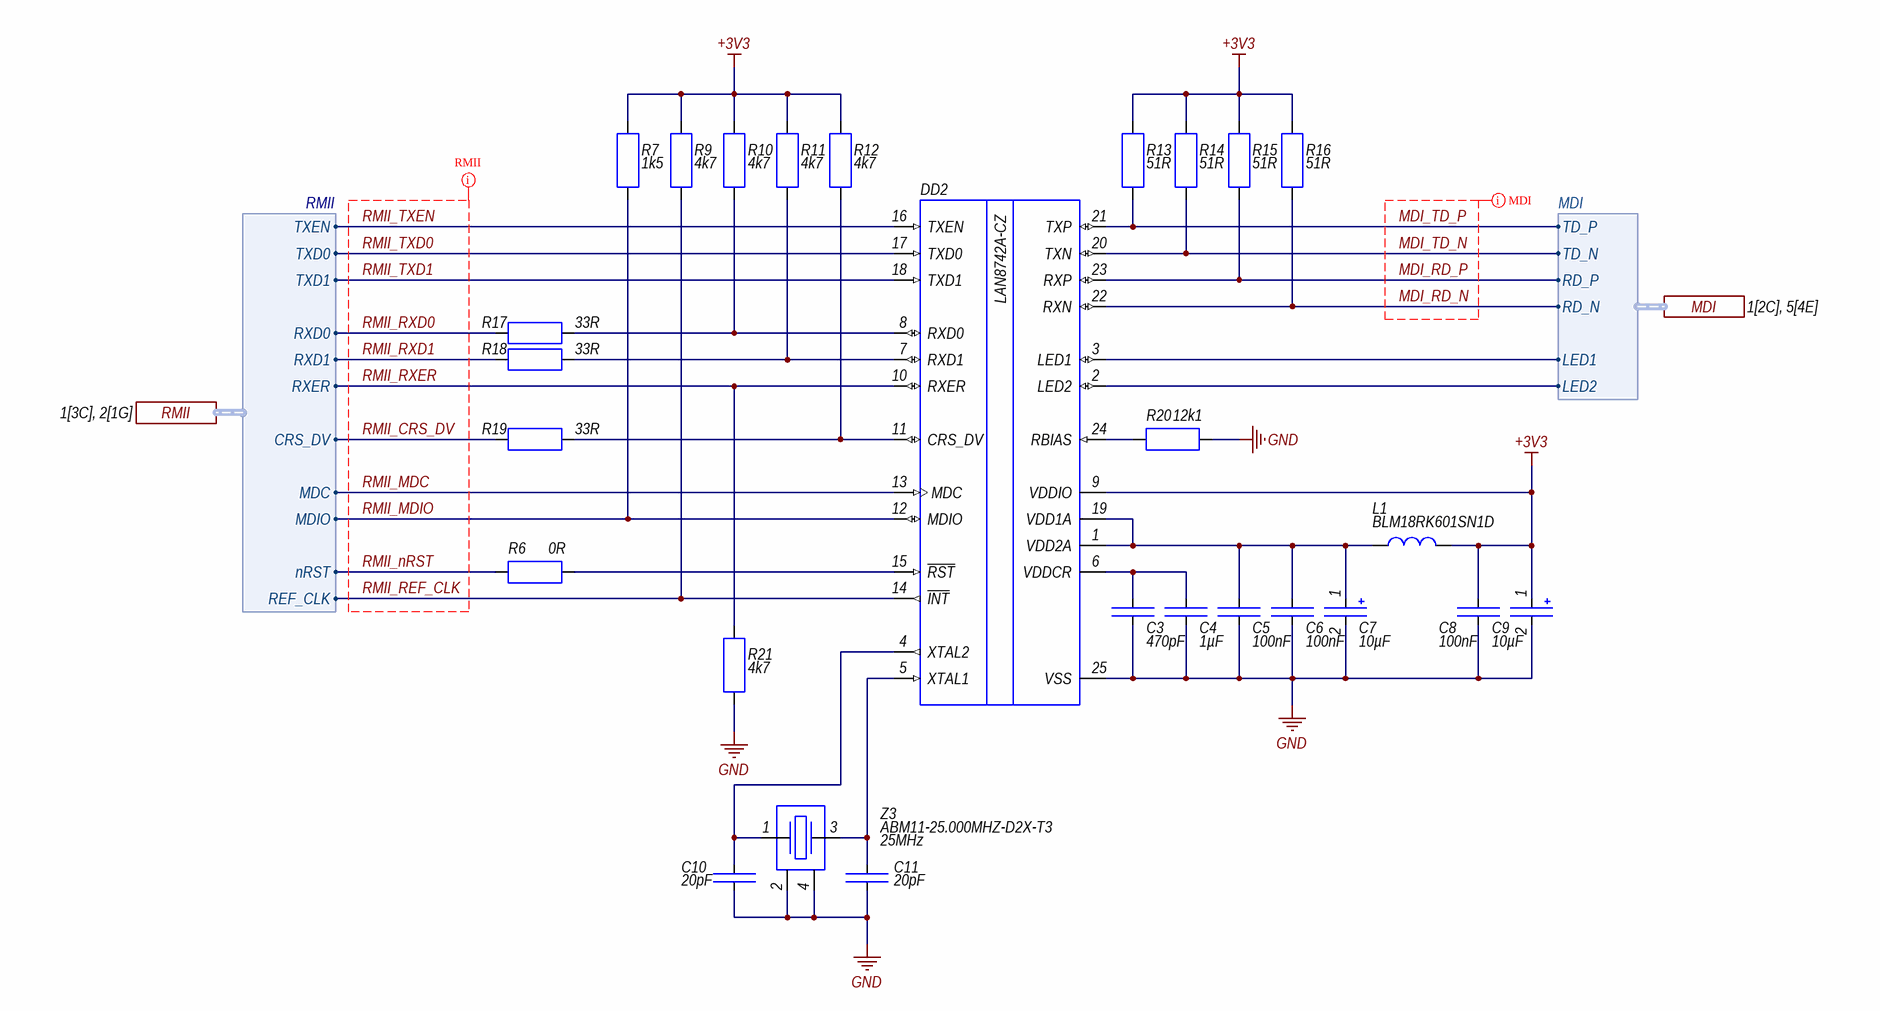
[diagram p8: RMII.SchDoc]

### Parts
C3  Capacitance: 470pF  [Capacitor 0603]  (hidden comment: Конденсатор керам. ЧИП Х7R, 5%, 0603, 470 пФ)
C4  Capacitance: 1µF  [Capacitor 0603]  (hidden comment: Конденсатор керам. ЧИП X5R, 10%, 0603, 1 мкФ)
C5  Device: 100nF  [Capacitor 0603]  (hidden comment: Конденсатор керам. ЧИП X7R, 10%, 0603, 0.1 мкФ)
C6  Device: 100nF  [Capacitor 0603]  (hidden comment: Конденсатор керам. ЧИП X7R, 10%, 0603, 0.1 мкФ)
C7  Device: 10µF  [SMD TANTAL-A]  (hidden comment: Конденсатор тантал. ЧИП 10мкФ х 16 В тип A (AА7))
C8  Device: 100nF  [Capacitor 0603]  (hidden comment: Конденсатор керам. ЧИП X7R, 10%, 0603, 0.1 мкФ)
C9  Device: 10µF  [SMD TANTAL-A]  (hidden comment: Конденсатор тантал. ЧИП 10мкФ х 16 В тип A (AА7))
C10  Capacitance: 20pF  [Capacitor 0603]  (hidden comment: Конденсатор керам. ЧИП NPO, 5%, 0603, 20 пФ)
C11  Capacitance: 20pF  [Capacitor 0603]  (hidden comment: Конденсатор керам. ЧИП NPO, 5%, 0603, 20 пФ)
DD2  Микросхема LAN8742A-CZ  [FP-C04-143B-S4QFN-MFG]  (value not drawn)
L1  Manufacturer Part Number: BLM18RK601SN1D  [BLM18HE152SN1D]  (hidden comment: Дроссель BLM18RK601SN1D)
R6  Device: 0R  [SMD_0402]  (hidden comment: Resistor)
R7  Device: 1k5  [SMD_0402]  (hidden comment: Resistor)
R9  Device: 4k7  [SMD_0402]  (hidden comment: Resistor)
R10  Device: 4k7  [SMD_0402]  (hidden comment: Resistor)
R11  Device: 4k7  [SMD_0402]  (hidden comment: Resistor)
R12  Device: 4k7  [SMD_0402]  (hidden comment: Resistor)
R13  Device: 51R  [SMD_0402]  (hidden comment: Resistor)
R14  Device: 51R  [SMD_0402]  (hidden comment: Resistor)
R15  Device: 51R  [SMD_0402]  (hidden comment: Resistor)
R16  Device: 51R  [SMD_0402]  (hidden comment: Resistor)
R17  Device: 33R  [SMD_0402]  (hidden comment: Resistor)
R18  Device: 33R  [SMD_0402]  (hidden comment: Resistor)
R19  Device: 33R  [SMD_0402]  (hidden comment: Resistor)
R20  Device: 12k1  [SMD_0402]  (hidden comment: Resistor)
R21  Device: 4k7  [SMD_0402]  (hidden comment: Resistor)
Z3  Manufacturer Part Number: ABM11-25.000MHZ-D2X-T3  Device: 25MHz  [ABM11-MFG]  (hidden comment: Резонатор ABM11-25.000MHZ-D2X-T3)

### Ports
MDI (harness MDI, see 1[2C], 5[4E]), RMII (harness RMII, see 1[3C], 2[1G])

### Harnesses
RMII: TXEN, TXD0, RXD0, RXD1, CRS_DV, RXER, MDC, MDIO, nRST, REF_CLK, TXD1
MDI: TD_P, TD_N, RD_P, RD_N, LED1, LED2

### Nets
+3V3: C8.1 C9.1 DD2.9(VDDIO) L1.2 R7.2 R9.2 R10.2 R11.2 R12.2 R13.2 R14.2 R15.2 R16.2
GND: C3.2 C4.2 C5.2 C6.2 C7.2 C8.2 C9.2 C10.2 C11.2 DD2.25(VSS) R20.2 R21.1 Z3.2 Z3.4
MDI_RD_N: DD2.22(RXN) R16.1 ; port MDI.RD_N
MDI_RD_P: DD2.23(RXP) R15.1 ; port MDI.RD_P
MDI_TD_N: DD2.20(TXN) R14.1 ; port MDI.TD_N
MDI_TD_P: DD2.21(TXP) R13.1 ; port MDI.TD_P
RMII_CRS_DV: R19.1 ; port RMII.CRS_DV  [project net PA7]
RMII_MDC: DD2.13(MDC) ; port RMII.MDC  [project net PC1]
RMII_MDIO: DD2.12(MDIO) R7.1 ; port RMII.MDIO  [project net PA2]
RMII_nRST: R6.1 ; port RMII.nRST  [project net nRST]
RMII_REF_CLK: DD2.14(~{INT}) R9.1 ; port RMII.REF_CLK  [project net PA1]
RMII_RXD0: R17.1 ; port RMII.RXD0  [project net PC4]
RMII_RXD1: R18.1 ; port RMII.RXD1  [project net PC5]
RMII_RXER: DD2.10(RXER) R21.2 ; port RMII.RXER  [project net PG2]
RMII_TXD0: DD2.17(TXD0) ; port RMII.TXD0  [project net PG13]
RMII_TXD1: DD2.18(TXD1) ; port RMII.TXD1  [project net PG14]
RMII_TXEN: DD2.16(TXEN) ; port RMII.TXEN  [project net PG11]
NetC3_1: C3.1 C4.1 DD2.6(VDDCR)
NetC5_1: C5.1 C6.1 C7.1 DD2.1(VDD2A) DD2.19(VDD1A) L1.1
NetC10_1: C10.1 DD2.4(XTAL2) Z3.1
NetC11_1: C11.1 DD2.5(XTAL1) Z3.3
NetDD2_2: DD2.2(LED2) ; port MDI.LED2
NetDD2_3: DD2.3(LED1) ; port MDI.LED1
NetDD2_7: DD2.7(RXD1) R11.1 R18.2
NetDD2_8: DD2.8(RXD0) R10.1 R17.2
NetDD2_11: DD2.11(CRS_DV) R12.1 R19.2
NetDD2_15: DD2.15(~{RST}) R6.2
NetDD2_24: DD2.24(RBIAS) R20.1

### Layout directives
differential pair; differential pair class MDI: MDI_RD_N, MDI_RD_P, MDI_TD_N, MDI_TD_P
net class RMII: RMII_CRS_DV, RMII_MDC, RMII_MDIO, RMII_nRST, RMII_REF_CLK, RMII_RXD0, RMII_RXD1, RMII_RXER, RMII_TXD0, RMII_TXD1, RMII_TXEN

### Notes on the sheet
- Подп. и дата
- Инв. № дубл.
- Взам. инв. №
- Инв. № подл.
- Изм.
- Лист
- № докум.
- Подп.
- Дата
- Копировал
- Формат А3

### Library data of the parts
C3 = 000171-4: Manufacturer: Kemet Electronics; Manufacturer Part Number: C0603C471J5RACTU; Device: 470pFx50V; Voltage: 50V; PCAD Reader Code: 0; Dielectric: X7R; Info: 470pFx50V; Case: 0603; Pin Count: 2; Storage Code: 0
C4 = 000825-3: Multilayer Ceramic Capacitors MLCC - SMD/SMT 0603 50V 1.0uF X5R 10%; Manufacturer: Murata Electronics; Manufacturer Part Number: GRT188R61H105KE13D; Device: 1µFx50V; PCAD Reader Code: 0; Info: 1µFx50V; Voltage: 50V; Case: 0603; Pin Count: 2; Help URL: https://www.digikey.com/en/products/detail/murata-electronics/GRT188R61H105KE13D/5416752; Storage Code: 0; Tolerance: 10%; Dielectric: X5R
C5 C6 C8 = 000129-4: Manufacturer: Yageo; Manufacturer Part Number: CC0603KPX7R9BB104; Info: 100nFx50V; Voltage: 50V; PCAD Reader Code: 6100; Capacitance: 100nF; Case: 0603; Pin Count: 2; Storage Code: 626; Dielectric: X7R
C7 C9 = 000184-4: Info: 10µFx16V; Voltage: 16V; PCAD Reader Code: 4376; Capacitance: 10µF; Case: Type A; Pin Count: 2; Storage Code: 623; Mounting: SMD
C10 C11 = 000172-5: Manufacturer: Murata Manufacturing; Manufacturer Part Number: GRM1885C1H200J; Device: 20pFx50V; Voltage: 50V; PCAD Reader Code: 10099; Info: 20pFx50V; Case: 0603; Pin Count: 2; Storage Code: 0; Dielectric: NPO
DD2 = 000989-2: Small Footprint RMII 10/100 Ethernet Transceiver with HP Auto-MDIX and flexPWR Technology; Manufacturer: Microchip; PCAD Reader Code: 0; Storage Code: 0; Manufacturer Part Number: LAN8742A-CZ; Info: LAN8742A-CZ; Case: QFN-24; Device: LAN8742A-CZ; Pin Count: 25
L1 = 000967-1: Ferrite Beads Multi-Layer 600Ohm 25% 100MHz 200mA 600mOhm DCR 0603 T/R; Manufacturer: Murata Electronics; PCAD Reader Code: 7563; DC Resistance: 0.6; Storage Code: 0; Help URL: https://www.murata.com/en-us/products/productdetail?partno=BLM18RK601SN1%23; Info: BLM18RK601SN1D; Case: 0603; Device: BLM18RK601SN1D; Pin Count: 2; Rated Current: 200mA
R6 R7 R9-R21 = Resistor_0402: Pin Count: 2; Part Number: Resistor_0402
  R6: Info: 0R; Resistance: 0R
  R7: Info: 1k5; Resistance: 1k5
  R9-R12 R21: Info: 4k7; Resistance: 4k7
  R13-R16: Info: 51R; Resistance: 51R
  R17-R19: Info: 33R; Resistance: 33R
  R20: Info: 12k1; Resistance: 12k1
Z3 = 000855-2: as Z1 on sheet STM32F7; Storage Code: 0; Help URL: https://www.farnell.com/datasheets/1936770.pdf; Info: ABM11-25.000MHZ-D2X-T3; Frequency: 25MHz; Pin Count: 4; Frequency Tolerance: 20ppm; Load Capacitance: 10pF

## Nets that join several sheets
+3V3: SDRAM_32_BGA (28 pins), STM32F7 (44 pins), QSPI (C66.1 DD4.8 R43.1), RMII (13 pins)
GND: SDRAM_32_BGA (44 pins), STM32F7 (57 pins), QSPI (C66.2 DD4.4 DD4.9), SOM-connectors (X314.61), RMII (14 pins)
CLK: STM32F7 (DD1.M5), QSPI (DD4.6)
FMC_A0: SDRAM_32_BGA (DD3.H9), STM32F7 (DD1.D2)
FMC_A1: SDRAM_32_BGA (DD3.J3), STM32F7 (DD1.E2)
FMC_A2: SDRAM_32_BGA (DD3.H2), STM32F7 (DD1.G2)
FMC_A3: SDRAM_32_BGA (DD3.H1), STM32F7 (DD1.H2)
FMC_A4: SDRAM_32_BGA (DD3.G1), STM32F7 (DD1.J2)
FMC_A5: SDRAM_32_BGA (DD3.G2), STM32F7 (DD1.K3)
FMC_A6: SDRAM_32_BGA (DD3.F3), STM32F7 (DD1.M6)
FMC_A7: SDRAM_32_BGA (DD3.G8), STM32F7 (DD1.N6)
FMC_A8: SDRAM_32_BGA (DD3.F7), STM32F7 (DD1.P6)
FMC_A9: SDRAM_32_BGA (DD3.G3), STM32F7 (DD1.M8)
FMC_A10: SDRAM_32_BGA (DD3.G7), STM32F7 (DD1.N7)
FMC_A11: SDRAM_32_BGA (DD3.G9), STM32F7 (DD1.M7)
FMC_BA0: SDRAM_32_BGA (DD3.J7), STM32F7 (DD1.N12)
FMC_BA1: SDRAM_32_BGA (DD3.H8), STM32F7 (DD1.N11)
FMC_CLK: SDRAM_32_BGA (DD3.J1), STM32F7 (DD1.H14)
FMC_D0: SDRAM_32_BGA (DD3.N8), STM32F7 (DD1.L12)
FMC_D1: SDRAM_32_BGA (DD3.P9), STM32F7 (DD1.K13)
FMC_D2: SDRAM_32_BGA (DD3.R9), STM32F7 (DD1.B12)
FMC_D3: SDRAM_32_BGA (DD3.R8), STM32F7 (DD1.C12)
FMC_D4: SDRAM_32_BGA (DD3.M7), STM32F7 (DD1.R8)
FMC_D5: SDRAM_32_BGA (DD3.N7), STM32F7 (DD1.N9)
FMC_D6: SDRAM_32_BGA (DD3.L8), STM32F7 (DD1.P9)
FMC_D7: SDRAM_32_BGA (DD3.M8), STM32F7 (DD1.R9)
FMC_D8: SDRAM_32_BGA (DD3.M3), STM32F7 (DD1.P10)
FMC_D9: SDRAM_32_BGA (DD3.L2), STM32F7 (DD1.R10)
FMC_D10: SDRAM_32_BGA (DD3.N2), STM32F7 (DD1.R12)
FMC_D11: SDRAM_32_BGA (DD3.N3), STM32F7 (DD1.P11)
FMC_D12: SDRAM_32_BGA (DD3.M2), STM32F7 (DD1.R11)
FMC_D13: SDRAM_32_BGA (DD3.R2), STM32F7 (DD1.L15)
FMC_D14: SDRAM_32_BGA (DD3.P1), STM32F7 (DD1.L14)
FMC_D15: SDRAM_32_BGA (DD3.R1), STM32F7 (DD1.K15)
FMC_NBL0: SDRAM_32_BGA (DD3.K9), STM32F7 (DD1.A6)
FMC_NBL1: SDRAM_32_BGA (DD3.K1), STM32F7 (DD1.A5)
FMC_NCAS: SDRAM_32_BGA (DD3.K7), STM32F7 (DD1.B7)
FMC_NRAS: SDRAM_32_BGA (DD3.J9), STM32F7 (DD1.P8)
FMC_NWE: SDRAM_32_BGA (DD3.K8), STM32F7 (DD1.J3)
FMC_SDCKE0: SDRAM_32_BGA (DD3.J2), STM32F7 (DD1.L4)
FMC_SDNE0: SDRAM_32_BGA (DD3.J8), STM32F7 (DD1.J4)
LTDC_B0: STM32F7 (DD1.A1), SOM-connectors (X314.27)
LTDC_B1: STM32F7 (DD1.B9), SOM-connectors (X314.25)
LTDC_B2: STM32F7 (DD1.C9), SOM-connectors (X314.23)
LTDC_B3: STM32F7 (DD1.D10), SOM-connectors (X314.21)
LTDC_B4: STM32F7 (DD1.C7), SOM-connectors (X314.19)
LTDC_B5: STM32F7 (DD1.D7), SOM-connectors (X314.17)
LTDC_B6: STM32F7 (DD1.C6), SOM-connectors (X314.15)
LTDC_B7: STM32F7 (DD1.C5), SOM-connectors (X314.13)
LTDC_G0: STM32F7 (DD1.J12), SOM-connectors (X314.43)
LTDC_G1: STM32F7 (DD1.H12), SOM-connectors (X314.41)
LTDC_G2: STM32F7 (DD1.J13), SOM-connectors (X314.39)
LTDC_G3: STM32F7 (DD1.H13), SOM-connectors (X314.37)
LTDC_G4: STM32F7 (DD1.G12), SOM-connectors (X314.35)
LTDC_G5: STM32F7 (DD1.G13), SOM-connectors (X314.33)
LTDC_G6: STM32F7 (DD1.F12), SOM-connectors (X314.31)
LTDC_G7: STM32F7 (DD1.F13), SOM-connectors (X314.29)
LTDC_R0: STM32F7 (DD1.G4), SOM-connectors (X314.59)
LTDC_R1: STM32F7 (DD1.R6), SOM-connectors (X314.57)
LTDC_R2: STM32F7 (DD1.R7), SOM-connectors (X314.55)
LTDC_R3: STM32F7 (DD1.P7), SOM-connectors (X314.53)
LTDC_R4: STM32F7 (DD1.N8), SOM-connectors (X314.51)
LTDC_R5: STM32F7 (DD1.M9), SOM-connectors (X314.49)
LTDC_R6: STM32F7 (DD1.M14), SOM-connectors (X314.47)
LTDC_R7: STM32F7 (DD1.K12), SOM-connectors (X314.45)
MDI_RD_N: SOM-connectors (X315.7), RMII (DD2.22 R16.1)
MDI_RD_P: SOM-connectors (X315.5), RMII (DD2.23 R15.1)
MDI_TD_N: SOM-connectors (X315.3), RMII (DD2.20 R14.1)
MDI_TD_P: SOM-connectors (X315.1), RMII (DD2.21 R13.1)
NCS: STM32F7 (DD1.B6), QSPI (DD4.1 R43.2)
NetDD2_2: SOM-connectors (X315.11), RMII (DD2.2)
NetDD2_3: SOM-connectors (X315.9), RMII (DD2.3)
nRST: STM32F7 (C16.1 DD1.J1 R8.2 X2.5), RMII (R6.1)
PA1: STM32F7 (DD1.N2), RMII (DD2.14 R9.1)
PA2: STM32F7 (DD1.P2), RMII (DD2.12 R7.1)
PA7: STM32F7 (DD1.R3), RMII (R19.1)
PA10: STM32F7 (DD1.D15), SOM-connectors (X314.18)
PC1: STM32F7 (DD1.M3), RMII (DD2.13)
PC4: STM32F7 (DD1.N5), RMII (R17.1)
PC5: STM32F7 (DD1.P5), RMII (R18.1)
PC8: STM32F7 (DD1.G14), SOM-connectors (X314.10)
PC9: STM32F7 (DD1.F14), SOM-connectors (X314.12)
PC10: STM32F7 (DD1.B14), SOM-connectors (X314.2)
PC11: STM32F7 (DD1.B13), SOM-connectors (X314.4)
PC12: STM32F7 (DD1.A12), SOM-connectors (X314.8)
PD2: STM32F7 (DD1.D12), SOM-connectors (X314.6)
PE2: STM32F7 (DD1.A3), QSPI (DD4.3)
PF6: STM32F7 (DD1.K2), QSPI (DD4.7)
PF8: STM32F7 (DD1.L3), QSPI (DD4.5)
PF9: STM32F7 (DD1.L2), QSPI (DD4.2)
PG2: STM32F7 (DD1.M13), RMII (DD2.10 R21.2)
PG11: STM32F7 (DD1.B8), RMII (DD2.16)
PG13: STM32F7 (DD1.B3), RMII (DD2.17)
PG14: STM32F7 (DD1.A4), RMII (DD2.18)
PI9: STM32F7 (DD1.E4), SOM-connectors (X314.9)
PI10: STM32F7 (DD1.D5), SOM-connectors (X314.11)
PI14: STM32F7 (DD1.H3), SOM-connectors (X314.63)
PK7: STM32F7 (DD1.C4), SOM-connectors (X314.7)
USB_FS_N: STM32F7 (DD1.C15), SOM-connectors (X314.16)
USB_FS_P: STM32F7 (DD1.B15), SOM-connectors (X314.14)